# EAGLE board M.2 SoM breakout board v0.2 (EAGLE 9.6.2), part 1 of 2
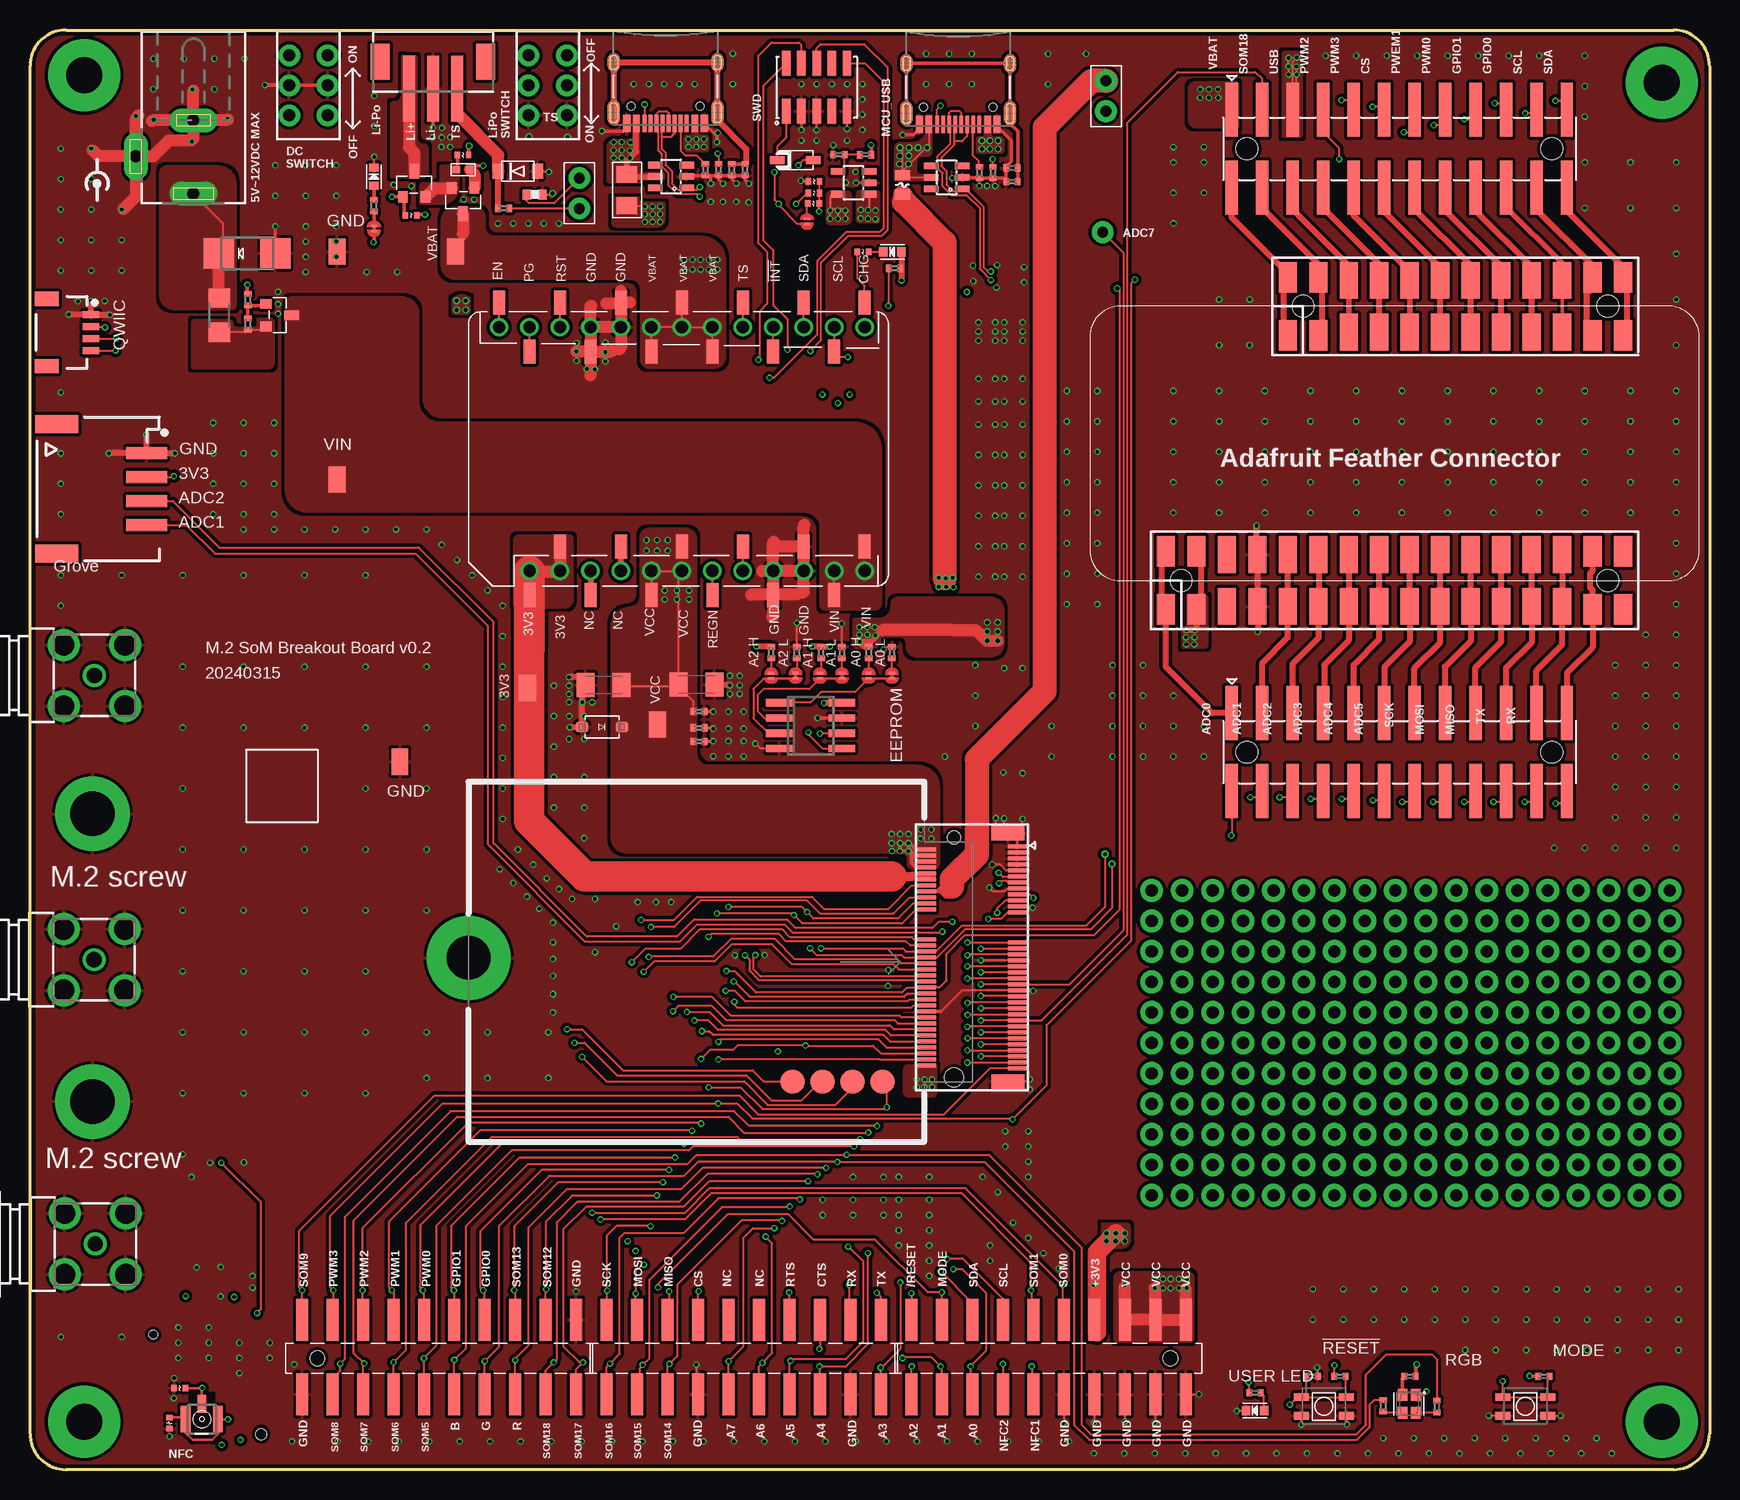
[diagram p3: board, top side]
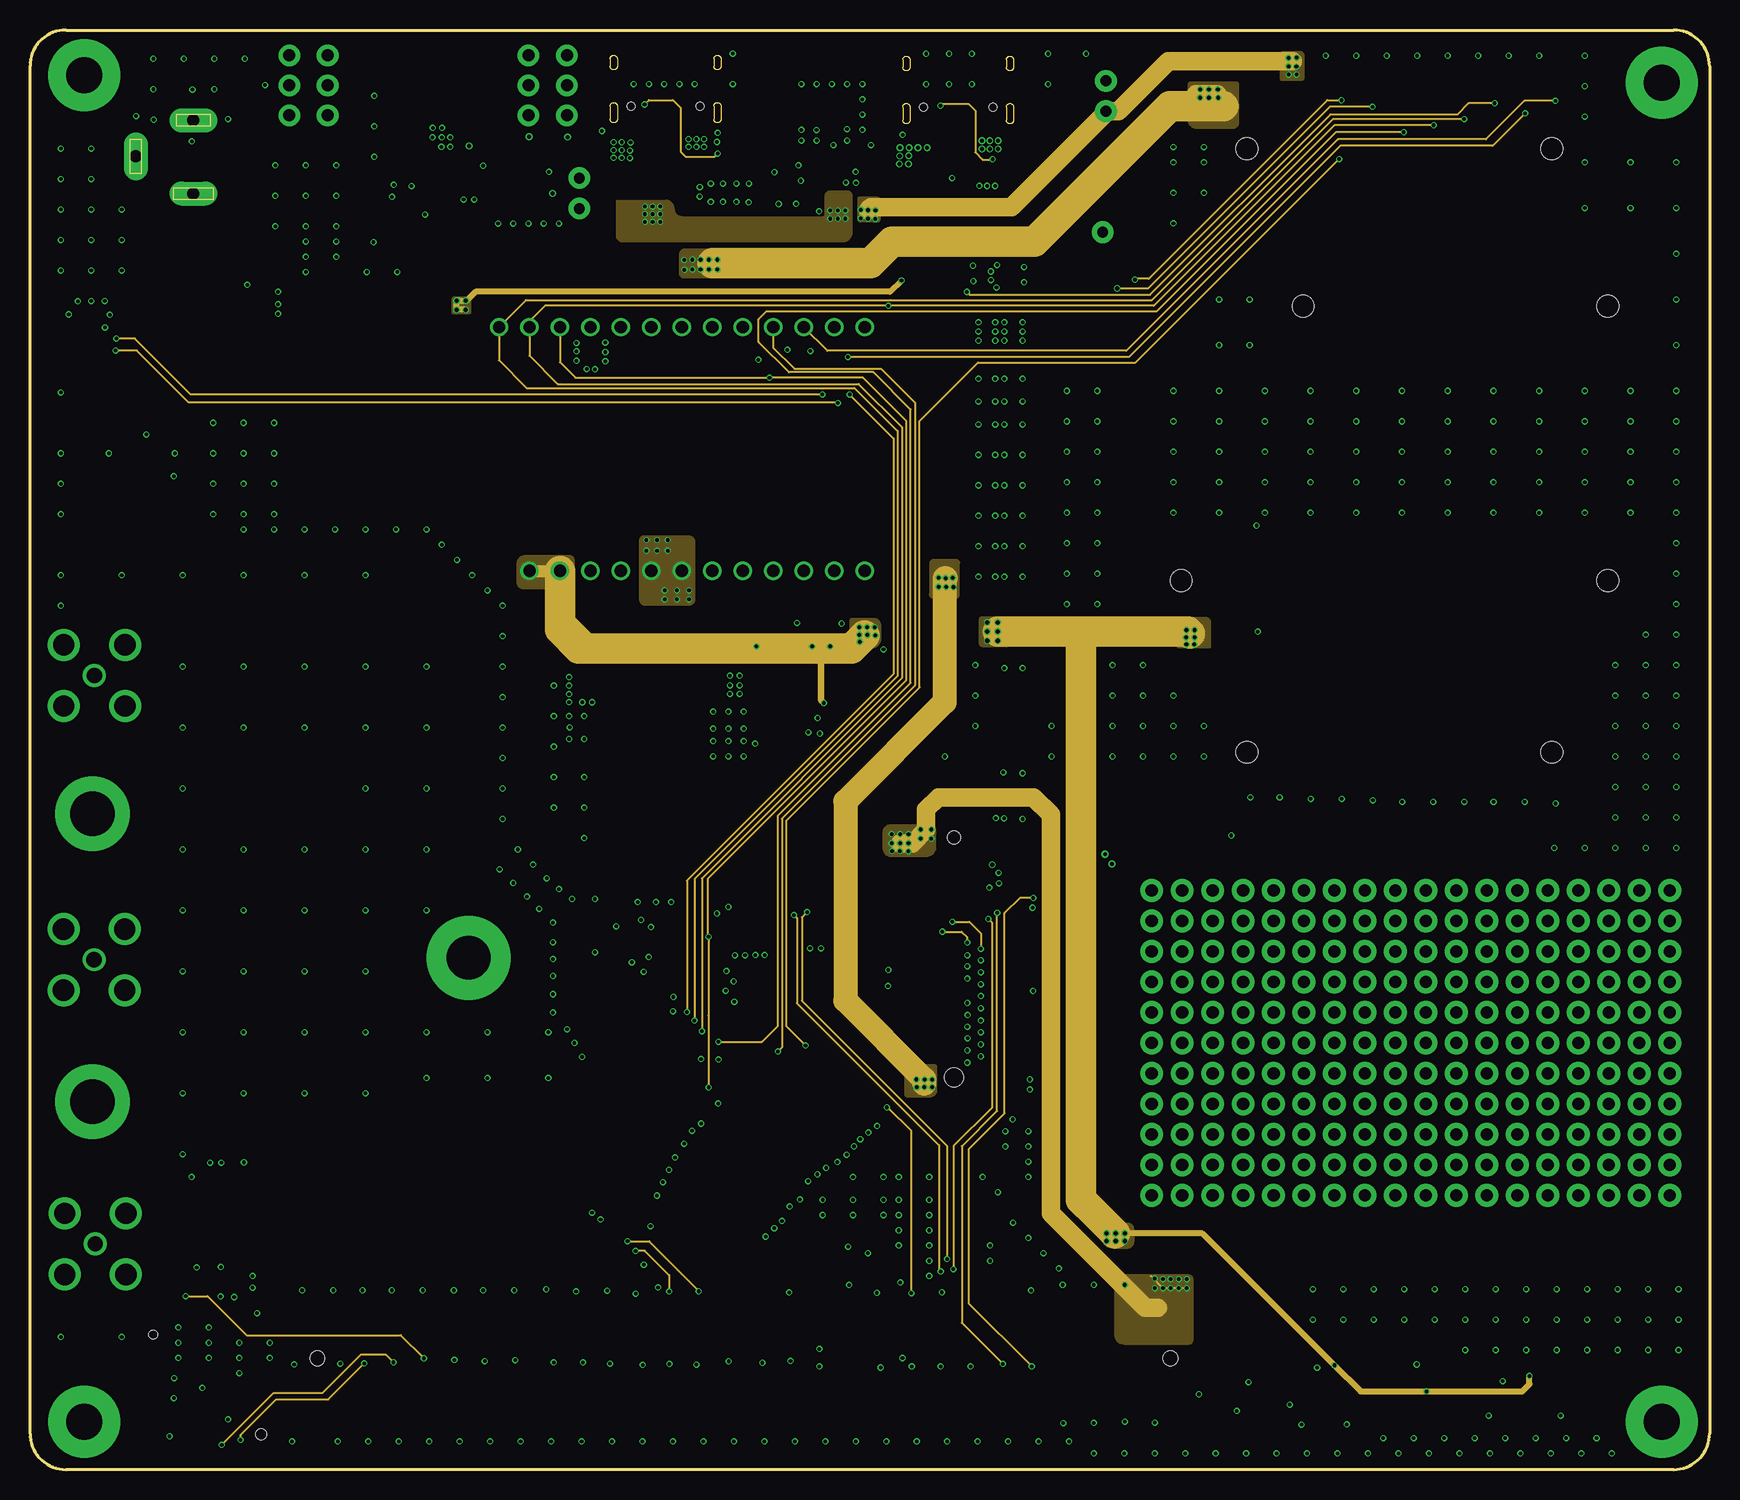
[diagram p4: board, inner layer VCC]
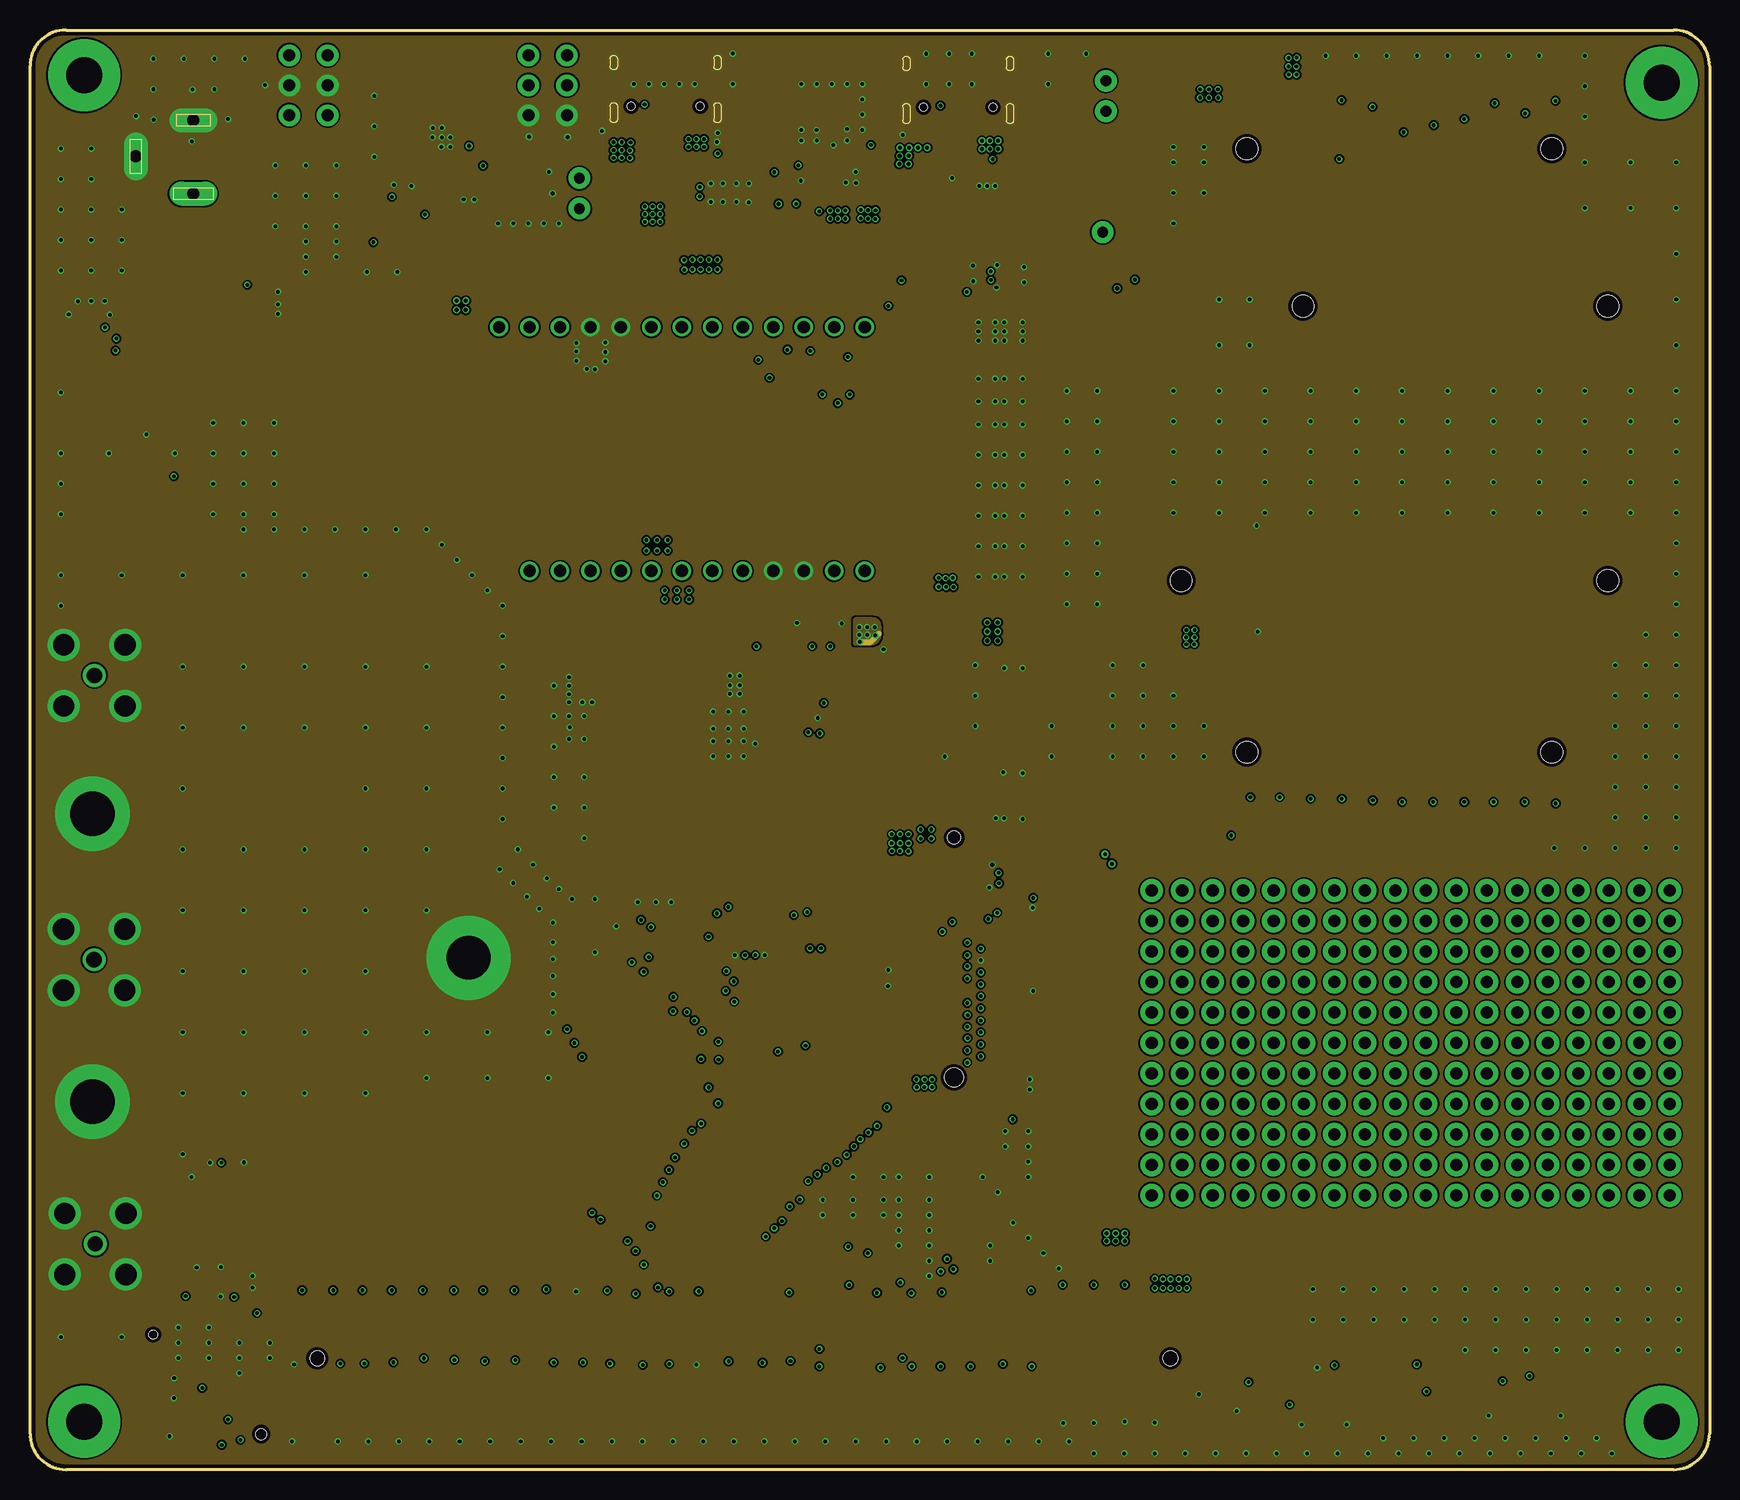
[diagram p5: board, inner layer GND]
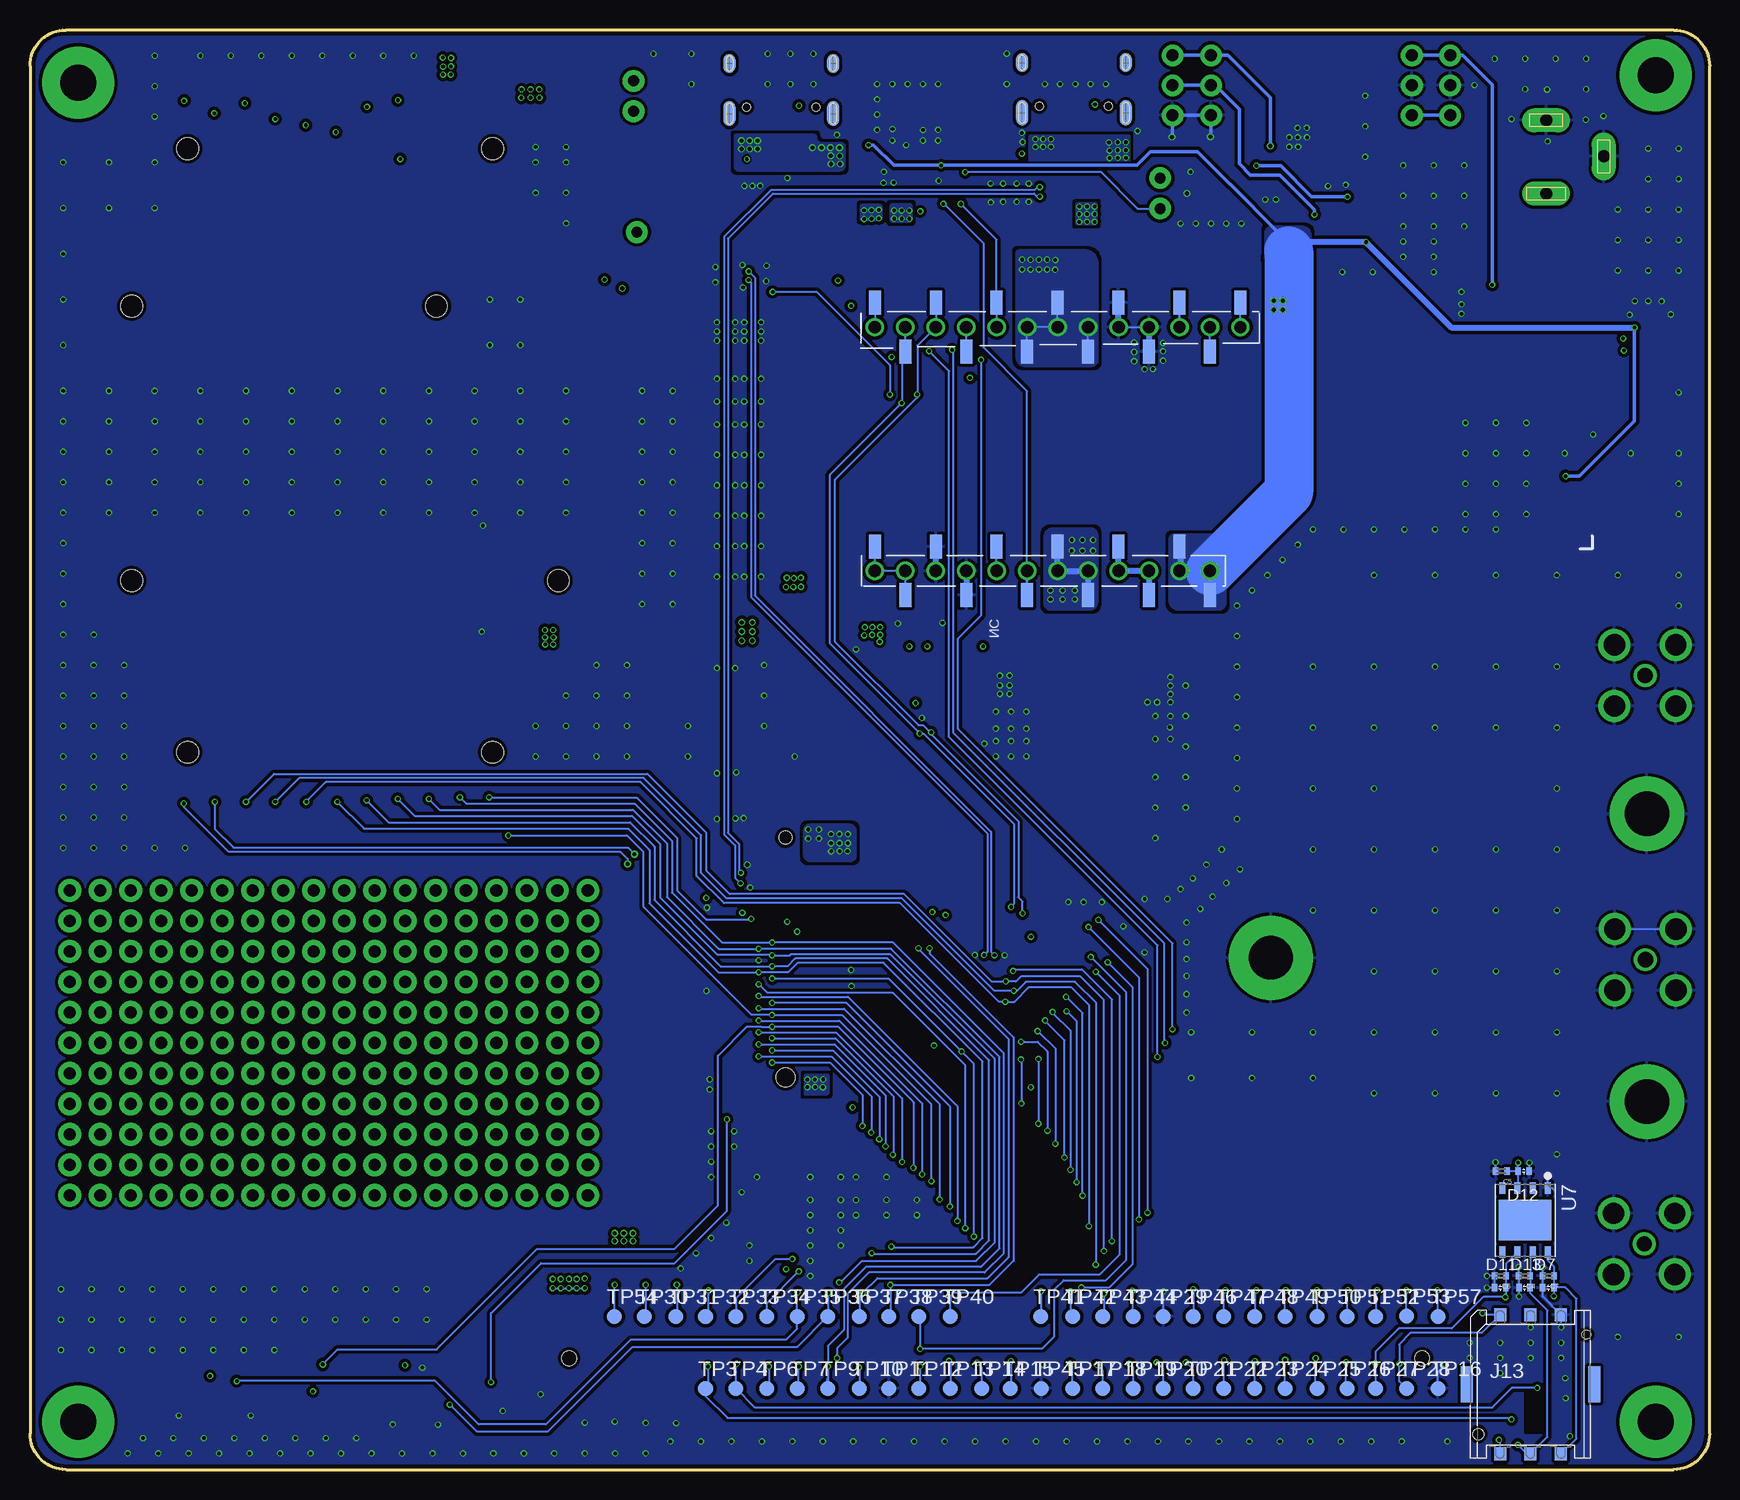
[diagram p6: board, bottom side, seen from below]

Size 140 x 120 mm. Coordinates in mm from the lower left corner, seen from the top.
Outline: 3,120 137,120 arc-90 140,117 140,3 arc-90 137,0 3,0 arc-90 0,3 0,117 arc-90 3,120
Copper layers (1+2*15+16): Top 0.035mm / dielectric 1.5mm / VCC 0.035mm / dielectric 0.15mm / GND 0.035mm / dielectric 0.2mm / Bottom 0.035mm
Design rules "default *": minimum track width 6mil, minimum drill 0.1mm, track to track 5mil, track to pad 5mil, pad to pad 5mil, via to via 5mil, smd to smd 5mil, copper to edge 12mil, drill to drill 6mil, minimum pad ring 4mil, minimum via ring 4mil, stop-mask expansion 4mil, vias tented up to drill 0.35mm, thermal gap 10mil
Net classes: 0 default: width 0.152 mm, clearance 0.152 mm; 1 power: width 0.254 mm, drill 0.61 mm, clearance 0.203 mm; 2 90R_Impedance: width 0.152 mm, drill 0.3 mm, clearance 0.152 mm; 3 BAT: clearance 0.203 mm

## Footprints (pad centres in the part's own frame; a part is rotated, then mirrored left to right if it is on the bottom)
S2751-46R = smd 2.2 x 1.4: 1 0,0
C0402_B = smd 0.457 x 0.61: 1 -0.483,0; 2 0.483,0
C1206K = smd 1.5 x 2: 1 -1.5,0; 2 1.5,0
SOT23-6 = smd 0.55 x 1.2: 1 -0.95,-1.3; 2 0,-1.3; 3 0.95,-1.3; 4 0.95,1.3; 5 0,1.3; 6 -0.95,1.3
SOD-123 = smd 1.2 x 0.7: 1 -1.5,0; 2 1.5,0
SOD-123FL = smd 0.91 x 1.22: A 1.637,0; C -1.637,0
C0402 = smd 0.45 x 0.6: 1 -0.47,0; 2 0.47,0
SOD-123' = smd 1.02 x 0.86: A 1.68,0; C -1.68,0
SMADIODE = smd 2.54 x 2.54: A 2.349,0; C -2.349,0
R1206 = smd 1.4 x 1.7: 1 -1.3,0; 2 1.3,0
F0805 = smd 0.85 x 1.25: P$1 -0.8,0; P$2 0.8,0
R1206' = smd 1.6 x 1.803: 1 -1.422,0; 2 1.422,0
JST-3-SMD-VERT = smd 1 x 5.5: 1 -2,0; 2 0,0; 3 2,0 | smd 1.6 x 3: PAD1 -4.4,-2.25; PAD2 4.4,-2.25
DCJ0202 = drill 1 pad 2 long: 1 0,3.1; 2 4.8,0; 3 0,-3
SPARK_CON_30X2_SMD = smd 1 x 3.5: 1 0,3.013; 2 0,-3.213; 3 2.54,3.013; 4 2.54,-3.213; 5 5.08,3.013; 6 5.08,-3.213; 7 7.62,3.013; 8 7.62,-3.213; 9 10.16,3.013; 10 10.16,-3.213; 11 12.7,3.013; 12 12.7,-3.213; 13 15.24,3.013; 14 15.24,-3.213; 15 17.78,3.013; 16 17.78,-3.213; 17 20.32,3.013; 18 20.32,-3.213; 19 22.86,3.013; 20 22.86,-3.213; 21 25.4,3.013; 22 25.4,-3.213; 23 27.94,3.013; 24 27.94,-3.213; 25 30.48,3.013; 26 30.48,-3.213; 27 33.02,3.013; 28 33.02,-3.213; 29 35.56,3.013; 30 35.56,-3.213; 31 38.1,3.013; 32 38.1,-3.213; 33 40.64,3.013; 34 40.64,-3.213; 35 43.18,3.013; 36 43.18,-3.213; 37 45.72,3.013; 38 45.72,-3.213; 39 48.26,3.013; 40 48.26,-3.213; 41 50.8,3.013; 42 50.8,-3.213; 43 53.34,3.013; 44 53.34,-3.213; 45 55.88,3.013; 46 55.88,-3.213; 47 58.42,3.013; 48 58.42,-3.213; 49 60.96,3.013; 50 60.96,-3.213; 51 63.5,3.013; 52 63.5,-3.213; 53 66.04,3.013; 54 66.04,-3.213; 55 68.58,3.013; 56 68.58,-3.213; 57 71.12,3.013; 58 71.12,-3.213; 59 73.66,3.013; 60 73.66,-3.213 | hole 1.2: 1.27,0; 72.39,0
1X04_1MM_RA = smd 0.6 x 1.35: 1 -1.5,0; 2 -0.5,0; 3 0.5,0; 4 1.5,0 | smd 1.2 x 2: NC1 2.8,-3.675; NC2 -2.8,-3.675
SCREW-HOLE-3.7 = drill 3.7 pad 6.2: P$1 0,0
PARTICLE-SZ_PARTICLE-POWER-MODULE = smd 1 x 2 bottom: 1 5.08,-0.762; 2 7.62,3.302; 3 10.16,-0.762; 4 12.7,3.302; 5 15.24,-0.762; 6 17.78,3.302; 7 20.32,-0.762; 8 22.86,3.302; 9 25.4,-0.762; 10 27.94,3.302; 11 30.48,-0.762; 12 33.02,3.302; 13 33.02,23.622; 14 30.48,19.55; 15 27.94,23.622; 16 25.4,19.55; 17 22.86,23.622; 18 20.32,19.55; 19 17.78,23.622; 20 15.24,19.55; 21 12.7,23.622; 22 10.16,19.55; 23 7.62,23.622; 24 5.08,19.558; 25 2.54,23.622 | smd 1 x 2: @1 5.08,-0.762; @2 7.62,3.302; @3 10.16,-0.762; @4 12.7,3.302; @5 15.24,-0.762; @6 17.78,3.302; @7 20.32,-0.762; @8 22.86,3.302; @9 25.4,-0.762; @10 27.94,3.302; @11 30.48,-0.762; @12 33.02,3.302; @13 33.02,23.622; @14 30.48,19.55; @15 27.94,23.622; @16 25.4,19.55; @17 22.86,23.622; @18 20.32,19.55; @19 17.78,23.622; @20 15.24,19.55; @21 12.7,23.622; @22 10.16,19.55; @23 7.62,23.622; @24 5.08,19.558; @25 2.54,23.622 | drill 1.016 pad 1.524: P$1 5.08,1.27; P$2 7.62,1.27; P$3 10.16,1.27; P$4 12.7,1.27; P$5 15.24,1.27; P$6 17.78,1.27; P$7 20.32,1.27; P$8 22.86,1.27; P$9 25.4,1.27; P$10 27.94,1.27; P$11 30.48,1.27; P$12 33.02,1.27; P$13 33.02,21.59; P$14 30.48,21.59; P$15 27.94,21.59; P$16 25.4,21.59; P$17 22.86,21.59; P$18 20.32,21.59; P$19 17.78,21.59; P$20 15.24,21.59; P$21 12.7,21.59; P$22 10.16,21.59; P$23 7.62,21.59; P$24 5.08,21.59; P$25 2.54,21.59
TP_OPEN = smd 0.2 x 0.5: 1 -0.21,0; 2 0.21,0
CON_12*2_SMD_HEADER = smd 1.02 x 4.5: 1 0,0.65; 2 0,-5.85; 3 2.54,0.65; 4 2.54,-5.85; 5 5.08,0.65; 6 5.08,-5.85; 7 7.62,0.65; 8 7.62,-5.85; 9 10.16,0.65; 10 10.16,-5.85; 11 12.7,0.65; 12 12.7,-5.85; 13 15.24,0.65; 14 15.24,-5.85; 15 17.78,0.65; 16 17.78,-5.85; 17 20.32,0.65; 18 20.32,-5.85; 19 22.86,0.65; 20 22.86,-5.85; 21 25.4,0.65; 22 25.4,-5.85; 23 27.94,0.65; 24 27.94,-5.85 | hole 1.8: 1.27,-2.6; 26.67,-2.6
WAFER-HY2.0-4PWB = smd 1 x 3.4: 1 -3,3.7; 2 -1,3.7; 3 1,3.7; 4 3,3.7 | smd 1.5 x 3.6: NC1 5.4,-3.8; NC2 -5.4,-3.8
GCT-SIM8100 = smd 1 x 1.1: C1 2.54,-5.8; C2 0,-5.8; C3 -2.54,-5.8; C5 2.54,5.8; C6 0,5.8; C7 -2.54,5.8 | smd 1 x 3: NC@1 -5.3,0; NC@2 5.3,0 | hole 0.7: 4.65,4.15 | hole 0.9: -4.35,-4.15
SIP-2 = drill 0.9 pad 1.8: 1 -1.27,0; 2 1.27,0
CONN5X2_1.27 = smd 0.7 x 2.1: 1 -2.54,-2; 2 -2.54,2; 3 -1.27,-2; 4 -1.27,2; 5 0,-2; 6 0,2; 7 1.27,-2; 8 1.27,2; 9 2.54,-2; 10 2.54,2
LED0603 = smd 0.7 x 0.8: 1 -0.75,0; 2 0.75,0
TACTILE_SWITCH_SMD = smd 1.25 x 0.65: 1 -1.875,0.775; 2 1.875,0.775; 3 -1.875,-0.775; 4 1.875,-0.775
FEATHERWING_SMT2 = smd 1.524 x 2.54: 1 6.35,2.413; 1' 6.35,-2.413; 2 8.89,2.413; 2' 8.89,-2.413; 15 41.91,2.413; 15' 41.91,-2.413; 16 44.45,2.413; 16' 44.45,-2.413; 17 44.45,20.447; 17' 44.45,25.273; 18 41.91,20.447; 18' 41.91,25.273; 27 19.05,20.447; 27' 19.05,25.273; 28 16.51,20.447; 28' 16.51,25.273 | smd 1.524 x 3.048: 3 11.43,2.159; 3' 11.43,-2.159; 4 13.97,2.159; 4' 13.97,-2.159; 5 16.51,2.159; 5' 16.51,-2.159; 6 19.05,2.159; 6' 19.05,-2.159; 7 21.59,2.159; 7' 21.59,-2.159; 8 24.13,2.159; 8' 24.13,-2.159; 9 26.67,2.159; 9' 26.67,-2.159; 10 29.21,2.159; 10' 29.21,-2.159; 11 31.75,2.159; 11' 31.75,-2.159; 12 34.29,2.159; 12' 34.29,-2.159; 13 36.83,2.159; 13' 36.83,-2.159; 14 39.37,2.159; 14' 39.37,-2.159; 19 39.37,20.701; 19' 39.37,25.019; 20 36.83,20.701; 20' 36.83,25.019; 21 34.29,20.701; 21' 34.29,25.019; 22 31.75,20.701; 22' 31.75,25.019; 23 29.21,20.701; 23' 29.21,25.019; 24 26.67,20.701; 24' 26.67,25.019; 25 24.13,20.701; 25' 24.13,25.019; 26 21.59,20.701; 26' 21.59,25.019 | hole 1.8: 17.78,22.86; 43.18,22.86; 7.62,0; 43.18,0
IPEX-20279-001E = smd 0.73 x 1.5: 1 0,1.28 | smd 0.8 x 2.2: 2@1 -1.35,0; 2@2 1.35,0
SOT-23 = smd 0.8 x 0.95: 1 -0.95,-1; 2 0.95,-1 | smd 0.8 x 1.25: 3 0,1.15
R0402_B = smd 0.457 x 0.61: 1 -0.483,0; 2 0.483,0
R-0402S = smd 0.45 x 0.55: 1 -0.47,0; 2 0.47,0
R0603_P = smd 0.7 x 0.85: 1 -0.65,0; 2 0.65,0
R0603 = smd 0.6 x 0.6: 1 -0.55,0; 2 0.55,0
PLCC4-2MM-RGB = smd 1 x 0.8: BLUE -0.75,-0.55; CA 0.75,-0.55; GREEN -0.75,0.55; RED 0.75,0.55
SWITCH-2.5X3.2-6 = drill 1 pad 1.8: 1 0,0; 2 0,2.5; 3 0,5; 4 3.2,0; 5 3.2,2.5; 6 3.2,5
TP_SHORT = smd 0.2 x 0.5: 1 -0.21,0; 2 0.21,0
TPEB = drill 0.9 pad 1.8: 1 0,0
B1,27 = smd 1.27 x 1.27: TP 0,0
SOT25 = smd 0.55 x 1.2: 1 -0.95,-1.3; 2 0,-1.3; 3 0.95,-1.3; 4 0.95,1.3; 5 -0.95,1.3
SO-08 = smd 0.6 x 2.2: 1 -1.905,-2.6; 2 -0.635,-2.6; 3 0.635,-2.6; 4 1.905,-2.6; 5 1.905,2.6; 6 0.635,2.6; 7 -0.635,2.6; 8 -1.905,2.6
MFF2 = smd 0.96 x 0.5: 1 -2.675,1.905; 2 -2.675,0.635; 3 -2.675,-0.635; 4 -2.675,-1.905; 5 2.675,-1.905; 6 2.675,-0.635; 7 2.675,0.635; 8 2.675,1.905 | smd 3.4 x 4.4: P$1 0,0
PARTICLE-STUDIOS_PARTICLE_M.2EKEY_3.65MM_DRILL = smd 0.3 x 1.55: 1 -9.62,3.735; 2 -9.37,-3.815; 3 -9.12,3.735; 4 -8.87,-3.815; 5 -8.62,3.735; 6 -8.37,-3.815; 7 -8.12,3.735; 8 -7.87,-3.815; 9 -7.62,3.735; 10 -7.37,-3.815; 11 -7.12,3.735; 12 -6.87,-3.815; 13 -6.62,3.735; 14 -6.37,-3.815; 15 -6.12,3.735; 16 -5.87,-3.815; 17 -5.62,3.735; 18 -5.37,-3.815; 19 -5.12,3.735; 20 -4.87,-3.815; 21 -4.62,3.735; 22 -4.37,-3.815; 23 -4.12,3.735; 32 -1.87,-3.815; 33 -1.62,3.735; 34 -1.37,-3.815; 35 -1.12,3.735; 36 -0.87,-3.815; 37 -0.62,3.735; 38 -0.37,-3.815; 39 -0.12,3.735; 40 0.13,-3.815; 41 0.38,3.735; 42 0.63,-3.815; 43 0.88,3.735; 44 1.13,-3.815; 45 1.38,3.735; 46 1.63,-3.815; 47 1.88,3.735; 48 2.13,-3.815; 49 2.38,3.735; 50 2.63,-3.815; 51 2.88,3.735; 52 3.13,-3.815; 53 3.38,3.735; 54 3.63,-3.815; 55 3.88,3.735; 56 4.13,-3.815; 57 4.38,3.735; 58 4.63,-3.815; 59 4.88,3.735; 60 5.13,-3.815; 61 5.38,3.735; 62 5.63,-3.815; 63 5.88,3.735; 64 6.13,-3.815; 65 6.38,3.735; 66 6.63,-3.815; 67 6.88,3.735; 68 7.13,-3.815; 69 7.38,3.735; 70 7.63,-3.815; 71 7.88,3.735; 72 8.13,-3.815; 73 8.38,3.735; 74 8.63,-3.815; 75 8.88,3.735 | smd 1.2 x 2.75: 76 9.98,2.96; 77 -10.72,2.96 | drill 3.65 pad 7: 78 -0.351,-42 | smd 2 x 2: !RESET 10,-7.5; SWCLK 10,-15; SWDIO 10,-12.5; SWO 10,-10 | hole 1.1: -10.37,-1.54 | hole 1.55: 9.63,-1.54
USB-C-16P = smd 0.3 x 1.45: A5 -1.25,0; A6 -0.25,0; A7 0.25,0; A8 1.25,0; B5 1.75,0; B6 0.75,0; B7 -0.75,0; B8 -1.75,0 | smd 0.6 x 1.45: GND -3.225,0; GND2 3.225,0 | smd 1 x 2.1: SHLD1 -4.32,-0.915; SHLD2 4.32,-0.915 | smd 1 x 2.1 bottom: SHLD3 -4.32,-0.915; SHLD4 4.32,-0.915 | smd 1 x 1.6: SHLD5 -4.32,-5.095; SHLD8 4.32,-5.095 | smd 1 x 1.6 bottom: SHLD6 -4.32,-5.095; SHLD7 4.32,-5.095 | smd 0.55 x 1.45: VBUS1 -2.45,0; VBUS2 2.45,0 | hole 0.65: -2.89,-1.445; 2.89,-1.445
BU-SMA-G = drill 1.27: 1 0,0 | drill 1.778: 2 -2.55,2.55; 3 2.55,2.55; 4 2.55,-2.55; 5 -2.55,-2.55

## Placement (x,y rotation side)
3V3  [S2751-46R]  41.48,65.15 90 top
C1  0.1uF  [C0402_B]  106.88,7.78 0 top
C2  0.1uF  [C0402_B]  81.85,107.35 180 top
C3  0.1uF  [C0402_B]  59.61,108.34 270 top
C4  33pF  [C0402_B]  15.43,16.15 180 bottom
C5  33pF  [C0402_B]  17.35,24.87 180 bottom
C6  33pF  [C0402_B]  17.45,16.15 180 bottom
C7  0.1uF  [C0402_B]  13.43,16.15 180 bottom
C8  1nF  [C0402_B]  55.77,63.18 0 top
C9  100pF  [C0402_B]  55.77,60.69 0 top
C10  33pF  [C0402_B]  55.77,61.82 0 top
C20  100uF  [C1206K]  55.57,65.42 0 top
C61  100uF  [C1206K]  47.83,65.39 180 top
D1  TPESD0504S6  [SOT23-6]  53.44,107.78 90 top
D2  B5819w  [SOD-123]  63.78,109.15 180 top
D4  SMF3.3  [SOD-123FL]  40.67,108.23 0 top
D7  0402ESDA-05N  [C0402]  13.43,15.16 0 bottom
D11  0402ESDA-05N  [C0402]  17.45,15.16 0 bottom
D12  0402ESDA-05N  [C0402]  15.5,24.87 180 bottom
D13  0402ESDA-05N  [C0402]  15.42,15.16 0 bottom
D16  BZT52C3V9  [SOD-123']  47.69,61.89 180 top
D17  SMAJ15CA-13-F  [SMADIODE]  18.11,101.38 0 top
D23  DNP MAX3207EAUT+T  [SOT23-6]  76.42,107.7 90 top
F2  RF1512-000  [R1206]  49.76,106.67 270 top
F4  Fuse  [F0805]  72.71,107.09 90 top
F5  16V/0.75A  [R1206']  15.79,96.22 270 top
GND  [S2751-46R]  25.61,101.52 90 top
GND15  [S2751-46R]  30.84,59 90 top
J1  [JST-3-SMD-VERT]  33.59,115.1 180 top
J2  DCJ0202  [DCJ0202]  13.62,109.46 180 top
J3  SPARK_CON_30X2_SMD  [SPARK_CON_30X2_SMD]  96.33,9.27 180 top
J4  [1X04_1MM_RA]  5.09,94.78 270 top
J5  SCREW-HOLE-3.7  [SCREW-HOLE-3.7]  5.21,54.66 0 top
J6  PARTICLE-SZ_PARTICLE-POWER-MODULE  [PARTICLE-SZ_PARTICLE-POWER-MODULE]  36.56,73.64 0 top
J7  SCREW-HOLE-3.7  [SCREW-HOLE-3.7]  5.21,30.68 0 top
J8  TP_OPEN  [TP_OPEN]  64.77,104.04 90 top
J10  CON_122_SMD_HEADER  [CON_12*2_SMD_HEADER]  100.17,112.7 0 top
J11  WAFER-HY2.0-4PWB  [WAFER-HY2.0-4PWB]  6.02,81.74 270 top
J12  TP_OPEN  [TP_OPEN]  61.78,66.16 270 top
J13  SIM-NANO-4FF  [GCT-SIM8100]  14.92,7.11 0 bottom
J15  CON_122_SMD_HEADER  [CON_12*2_SMD_HEADER]  100.17,62.4 0 top
J19  TP_OPEN  [TP_OPEN]  65.85,66.16 270 top
J20  TP_OPEN  [TP_OPEN]  69.91,66.16 270 top
J21  SIP-2  [SIP-2]  45.78,106.38 90 top
J22  SIP-2  [SIP-2]  89.69,114.5 270 top
JTAG  CONN5X2  [CONN5X2_1.27]  65.57,115.22 0 top
LED1  RED  [LED0603]  28.67,107.77 90 top
LED2  BLUE  [LED0603]  102.11,4.91 180 top
LED3  yellow  [LED0603]  71.88,101.51 180 top
MODE  [TACTILE_SWITCH_SMD]  124.65,5.26 180 top
MS1  PARTICLE_MESH_SMTDUAL  [FEATHERWING_SMT2]  88.34,74.11 0 top
NFC  UFL  [IPEX-20279-001E]  14.33,4.2 0 top
Q3  HSS2333  [SOT-23]  36.1,105.82 180 top
Q4  HSS2333  [SOT-23]  20.66,96.22 270 top
Q5  HSS2333  [SOT-23]  32.03,107.09 0 top
R1  5.1k  [R0402_B]  79.15,108.11 270 top
R2  1K  [R0402_B]  69.64,109.59 0 top
R3  5.1k  [R0402_B]  80.27,108.11 270 top
R4  10K  [R0402_B]  109.2,7.78 180 top
R5  1M  [R0402_B]  81.85,108.5 180 top
R6  5.1k  [R0402_B]  56.3,108.34 270 top
R7  1M  [R0402_B]  67.42,109.6 180 top
R8  1K  [R0402_B]  117.26,5.25 270 top
R9  5.1k  [R0402_B]  57.4,108.34 270 top
R10  1M  [R0402_B]  58.51,108.34 270 top
R11  1K  [R0402_B]  102.11,6.4 180 top
R12  DNP  [R0402_B]  126.18,7.78 180 top
R13  1K  [R-0402S]  69.44,101.51 180 top
R14  100K  [R0402_B]  18.16,95.49 270 top
R15  1K  [R0402_B]  18.16,97.51 270 top
R16  1K  [R0402_B]  28.67,105.35 270 top
R18  nc  [R-0402S]  65.34,106.4 180 top
R19  1K  [R0402_B]  112.79,5.32 270 top
R20  1K  [R0402_B]  115.04,7.78 180 top
R21  1M/NC  [R0402_B]  72.06,100.13 0 top
R22  10K  [R0603_P]  42.06,106.27 180 top
R23  0R  [R0402_B]  39.47,105.13 180 top
R24  10K  [R0402_B]  61.78,68.11 90 top
R25  10K  [R0402_B]  65.95,68.11 90 top
R26  10K  [R0402_B]  69.91,68.11 90 top
R27  100K  [R0402_B]  63.92,68.11 90 top
R28  100K  [R0402_B]  67.68,68.11 90 top
R29  100K  [R0402_B]  71.84,68.11 90 top
R30  100K  [R0603]  36.1,108.36 180 top
R31  1K  [R-0402S]  31.78,104.55 0 top
R32  nc  [R-0402S]  65.31,105.54 180 top
R33  1K  [R-0402S]  36.1,109.58 180 top
R37  ESD NC  [R-0402S]  11.62,3.87 270 top
R38  ESD NC  [R-0402S]  12.48,6.78 0 top
R74  nc  [R-0402S]  65.34,107.37 0 top
RESET  [TACTILE_SWITCH_SMD]  107.86,5.26 180 top
RGB  RGB-LED-CLMVB-FKARGB  [PLCC4-2MM-RGB]  114.95,5.47 90 top
S1  [SWITCH-2.5X3.2-6]  21.61,112.89 0 top
S4  [SWITCH-2.5X3.2-6]  44.76,117.89 180 top
T1  TP_SHORT  [TP_SHORT]  28.67,103.44 90 top
TP1  TPTPEB  [TPEB]  89.41,103.15 0 top
TP3  TPSB1,27  [B1,27]  83.69,6.76 0 bottom
TP4  TPSB1,27  [B1,27]  81.16,6.76 0 bottom
TP6  TPSB1,27  [B1,27]  78.59,6.76 0 bottom
TP7  TPSB1,27  [B1,27]  76.04,6.76 0 bottom
TP9  TPSB1,27  [B1,27]  73.5,6.76 0 bottom
TP10  TPSB1,27  [B1,27]  70.87,6.76 0 bottom
TP11  TPSB1,27  [B1,27]  68.4,6.76 0 bottom
TP12  TPSB1,27  [B1,27]  65.92,6.76 0 bottom
TP13  TPSB1,27  [B1,27]  63.3,6.76 0 bottom
TP14  TPSB1,27  [B1,27]  60.66,6.76 0 bottom
TP15  TPSB1,27  [B1,27]  58.29,6.76 0 bottom
TP16  TPSB1,27  [B1,27]  22.64,6.76 0 bottom
TP17  TPSB1,27  [B1,27]  53.08,6.76 0 bottom
TP18  TPSB1,27  [B1,27]  50.58,6.76 0 bottom
TP19  TPSB1,27  [B1,27]  48.03,6.76 0 bottom
TP20  TPSB1,27  [B1,27]  45.52,6.76 0 bottom
TP21  TPSB1,27  [B1,27]  43.03,6.76 0 bottom
TP22  TPSB1,27  [B1,27]  40.49,6.76 0 bottom
TP23  TPSB1,27  [B1,27]  37.91,6.76 0 bottom
TP24  TPSB1,27  [B1,27]  35.38,6.76 0 bottom
TP25  TPSB1,27  [B1,27]  32.69,6.76 0 bottom
TP26  TPSB1,27  [B1,27]  30.2,6.76 0 bottom
TP27  TPSB1,27  [B1,27]  27.81,6.76 0 bottom
TP28  TPSB1,27  [B1,27]  25.25,6.76 0 bottom
TP29  TPSB1,27  [B1,27]  45.52,12.77 0 bottom
TP30  TPSB1,27  [B1,27]  88.8,12.77 0 bottom
TP31  TPSB1,27  [B1,27]  86.15,12.77 0 bottom
TP32  TPSB1,27  [B1,27]  83.69,12.77 0 bottom
TP33  TPSB1,27  [B1,27]  81.16,12.77 0 bottom
TP34  TPSB1,27  [B1,27]  78.59,12.77 0 bottom
TP35  TPSB1,27  [B1,27]  76.04,12.77 0 bottom
TP36  TPSB1,27  [B1,27]  73.5,12.77 0 bottom
TP37  TPSB1,27  [B1,27]  70.87,12.77 0 bottom
TP38  TPSB1,27  [B1,27]  68.4,12.77 0 bottom
TP39  TPSB1,27  [B1,27]  65.92,12.77 0 bottom
TP40  TPSB1,27  [B1,27]  63.3,12.77 0 bottom
TP41  TPSB1,27  [B1,27]  55.75,12.77 0 bottom
TP42  TPSB1,27  [B1,27]  53.08,12.77 0 bottom
TP43  TPSB1,27  [B1,27]  50.58,12.77 0 bottom
TP44  TPSB1,27  [B1,27]  48.03,12.77 0 bottom
TP45  TPSB1,27  [B1,27]  55.7,6.76 0 bottom
TP46  TPSB1,27  [B1,27]  43.03,12.77 0 bottom
TP47  TPSB1,27  [B1,27]  40.49,12.77 0 bottom
TP48  TPSB1,27  [B1,27]  37.91,12.77 0 bottom
TP49  TPSB1,27  [B1,27]  35.38,12.77 0 bottom
TP50  TPSB1,27  [B1,27]  32.69,12.77 0 bottom
TP51  TPSB1,27  [B1,27]  30.2,12.77 0 bottom
TP52  TPSB1,27  [B1,27]  27.81,12.77 0 bottom
TP53  TPSB1,27  [B1,27]  25.25,12.81 0 bottom
TP54  TPSB1,27  [B1,27]  91.3,12.77 0 bottom
TP57  TPSB1,27  [B1,27]  22.64,12.77 0 bottom
U1  XC8107  [SOT25]  68.65,107.26 90 top
U2  AT24CS64-SSHM-B  [SO-08]  65.07,62.02 270 top
U7  NC  [MFF2]  15.37,20.79 270 bottom
U$2  TP_SHORT  [TP_SHORT]  63.82,66.16 270 top
U$3  TP_SHORT  [TP_SHORT]  67.68,66.16 270 top
U$4  PARTICLE-STUDIOS_M_SERIES_M.2KEY  [PARTICLE-STUDIOS_PARTICLE_M.2EKEY_3.65MM_DRILL]  78.56,42.31 270 top
U$6  PARTICLE-LOGO  [PARTICLE-LOGO]  16.37,72.5 0 top
U$7  TP_SHORT  [TP_SHORT]  71.84,66.16 270 top
USB1  [USB-C-16P]  52.98,112.19 180 top
USB2  [USB-C-16P]  77.37,112.12 180 top
VBAT  [S2751-46R]  35.49,101.52 270 top
VCC  [S2751-46R]  52.3,62.1 90 top
VIN  [S2751-46R]  25.61,82.52 90 top
X1  BU-SMA-G  [BU-SMA-G]  5.44,18.81 180 top
X2  BU-SMA-G  [BU-SMA-G]  5.37,66.19 180 top
X3  BU-SMA-G  [BU-SMA-G]  5.34,42.5 180 top

## Tracks (layer width: path | path; a pad name or v marks a point on that pad's centre or on a via)
5VDC
  Top 0.152: 49.26,76.83 J6.4
  Top 0.508: J6.P$3 J6.@3 | J6.P$4 49.26,76.83
  Bottom 0.152: J6.P$4 49.26,74.93 | 49.26,74.93 49.26,76.71 J6.4 | 46.72,73.15 J6.@3 | J6.P$3 46.73,74.93 49.26,74.93
  Bottom 0.508: 46.72,73.15 J6.P$3 J6.P$4 49.26,76.71
!MODE  (via drill 0.3 pad 0.5)
  Top 0.152: U$4.32 73.69,44.18 73.48,44.4 63.33,44.4 62.72,45 55.83,45 54.24,43.41 51.29,43.41 v50.17,42.28 | J3.18 76.01,14.77 v76,14.77 74.84,14.77 70.41,19.2 65.28,19.2 63.17,21.31 58.19,21.31 52.35,15.47 v52.35,15.18 | R12.1 126.52,7.64 MODE.3 MODE.4 122.77,7.36 v122.76,7.37
  Bottom 0.152: v76,14.77 76.04,14.77 TP35.TP 76.04,11.74 76.97,10.82 89.92,10.82 96.98,3.76 102.59,3.76 106.25,7.42 122.71,7.42 v122.76,7.37 | v50.17,42.28 48.11,40.23 48.11,17.1 50.05,15.16 52.33,15.16 v52.35,15.18
!RESET  (via drill 0.3 pad 0.5)
  Top 0.152: v73.47,14.7 J3.20 | C1.1 106.39,6.45 106.09,6.15 | 106.09,6.15 RESET.4 RESET.3 109.68,6.09 R4.1 | JTAG.10 69.59,117.22 71.18,115.63 71.18,103.5 70.85,103.17 68.06,103.17 65.65,100.76 65.65,94.63 62.03,91.01 v61.65,91.01 | v105.01,5.41 105.75,6.15 106.09,6.15 | U$4.34 73.38,43.68 73.02,44.04 63.04,44.04 62.45,44.63 56.77,44.63 v56.56,44.41 | U$4.!RESET 70.83,32.31 71.43,31.71 v71.43,30.18 71.3,30.05 61.04,30.05 59.25,31.85 v56.57,31.85 | J6.23 J6.P$23
  VCC 0.152: v73.47,14.7 73.47,28.21 71.5,30.18 v71.43,30.18 | J6.P$23 44.18,92.3 45.47,91.01 v61.65,91.01 69.42,91.01 73.05,87.38 73.05,65.81 56.51,49.27 56.51,44.46 v56.56,44.41 56.56,37.83 56.57,37.82 v56.57,31.85
  Bottom 0.152: v73.47,14.7 73.47,12.77 TP36.TP 76.08,10.2 89.81,10.2 96.85,3.15 102.72,3.15 104.98,5.41 v105.01,5.41 | 44.61,97.66 44.18,97.23 J6.P$23 J6.23
+3V3  (via drill 0.3 pad 0.5, 0.35)
  Top 0.152: v88.67,15.39 v88.66,15.38 88.66,12.53 J3.8 | R4.2 108.71,8.66 v108.74,8.69 | J4.2 6.17,95.28 v6.25,95.2 | J11.2 11.93,82.74 v11.99,82.8 | 28.67,102.35 v28.63,102.31 | v66.18,63.9 v66.17,63.89 | v72.65,99.12 | MS1.2 97.67,76.09 97.67,75.74 | J6.@1 41.64,74.47 41.64,74.83 J6.P$1 | v70.46,69.53 69.91,68.98 R26.2 | D2.1 64.47,109.15 64.05,108.72 v64.05,108.71
  Top 0.305: U$4.10 U$4.12 73.81,49.18 73.56,49.44 74.5,49.44 U$4.10 | 73.48,49.43 73.74,49.68 U$4.10 | v70.1,110.41 70.13,110.38 R2.2 | R12.2 125.02,7.78 v125,7.8 | v116.41,6.5 116.13,6.22 RGB.CA | R21.2 72.63,100.13 72.65,100.1 | T1.1 28.67,102.35
  Top 0.457: v65.2,68.62 65.93,68.62 R25.2 65.97,68.62 v66.7,68.62
  Top 0.508: 97.67,76.96 97.67,75.74 97.67,72.23 97.23,71.79 MS1.2' 97.23,70.13 v97.08,69.98 v96.4,69.98 | LED3.1 72.63,100.13 | 72.65,100.1 v72.65,99.12 | U2.8 67.65,63.9 v66.18,63.9 | v79.78,69.09 78.9,69.98 76.94,69.98 | 71.03,69.98 70.06,69 v69.17,69 69.57,68.6 R26.2 | R24.2 60.58,68.6 v60.56,68.62 | 65.92,68.62 v65.21,68.62 v65.2,68.62 | 65.63,68.62 v66.7,68.62
  Top 0.762: 75.11,49.44 73.56,49.44 71.81,49.44
  Top 1.016: J6.@2 J6.P$2 44.09,74.83 41.64,74.83 | 71.03,69.98 76.94,69.98 78.84,69.98 79.73,69.09 v80.67,69.09 | J3.8 88.71,17.97 90.43,19.68 v90.5,19.68 | 3V3.1 41.61,65.28 41.61,66.14
  Top 1.524: 41.61,74.45 41.64,74.47 | v90.5,19.68 88.93,18.11 88.93,11.43
  Top 2.54: 41.61,68.35 41.61,74.45 41.61,74.89 J6.P$1 41.64,68.38 41.61,68.35 | 41.61,68.35 41.61,66.14 41.61,54.05 46.22,49.44 71.81,49.44
  VCC 0.152: v69.14,70.22 v69.14,69.58 v69.8,69.58 69.75,69.58 v69.17,69 | v69.14,70.22 v69.78,70.22 | v70.41,70.22 70.46,70.17 v70.46,69.53 | v69.14,70.22 69.14,69.1 68.5,68.45 | v79.78,70.61 80.62,70.61 80.67,70.56 v80.67,69.85 | v79.78,70.61 v79.78,69.09 79.86,69.09 | 79.86,69.09 v80.67,69.09 v80.67,69.85 | v79.78,70.61 v79.78,69.85 79.86,69.77 79.86,69.09 | 87.61,68.05 85.8,69.85 v80.67,69.85
  VCC 0.508: v125,7.8 125,7.11 124.39,6.5 v116.41,6.5 110.92,6.5 v108.74,8.69 108.72,8.69 97.72,19.68 90.45,19.68 | v66.17,63.89 66.07,63.99 | v72.65,99.12 v72.64,99.12 72.63,99.12 71.68,98.17 37.14,98.17 36.4,97.43 v35.56,97.43 | v60.56,68.62 61.3,69.37 65.95,69.37 | 65.95,69.37 66.07,69.37 | v36.33,96.67 v35.56,96.67 v35.56,97.43 | 35.66,97.48 35.72,97.43 v35.56,97.43 | v65.2,68.62 65.95,69.37 | 69.04,68.62 v66.7,68.62 | 65.94,67.84 65.94,64.12 v66.17,63.89 | 65.92,68.72 65.92,64.15 v66.17,63.89
  VCC 1.016: J6.P$1 J6.P$2 44.18,71.62 47.18,68.62 v60.56,68.62 60.65,68.72 65.92,68.72 | 69.04,68.62 v65.2,68.62 | v97.08,69.98 96.95,69.98 96.67,69.7 96.65,69.67 | v90.5,19.68 90.45,19.68 90.4,19.68 87.99,22.1
  VCC 2.54: J6.P$2 44.18,70.02 45.75,68.45 68.5,68.45 69.57,69.53 | 90.45,19.68 87.61,22.52 | v80.67,69.85 96.52,69.85 96.67,69.7 | 87.99,22.1 87.61,22.48 87.61,68.05 87.61,68.99
  GND 0.508: v69.17,69 70.07,69 70.74,69.67
  Bottom 0.152: v88.67,15.39 v88.68,15.39 88.68,12.9 TP30.TP | J6.@2 J6.P$2 44.1,74.91 J6.P$1 | v28.63,102.31 34.17,102.31 34.19,102.29
  Bottom 0.254: 35.84,102.29 35.97,102.16 35.97,101.96
  Bottom 0.305: v70.1,110.41 69.67,110.41 67.97,108.71 v64.05,108.71 64.02,108.74 47.73,108.74 46.61,109.86 42.7,109.86 39.98,107.14 39.96,107.14 36.02,103.2 36.02,102.41 35.97,102.36 | 35.97,102.29 35.84,102.29 34.19,102.29 | v11.99,82.8 10.85,82.8 6.25,87.4 v6.25,95.2
  Bottom 0.508: J6.@2 44.1,76.94 44.1,74.91 | J6.P$1 J6.@1 | J6.@1 41.64,72.22 41.56,72.14 41.56,72.8 J6.@1 | 35.97,102.36 35.97,102.29 35.97,101.96 35.78,102.15 | 35.61,102.31 35.78,102.15 | v35.56,97.43 35.56,101.93 35.78,102.15 | v36.33,97.43 v36.33,96.67 | 35.08,101.6 34.37,102.31 v28.63,102.31 21.52,95.2 v6.25,95.2
  Bottom 4.064: J6.P$1 35.08,81.47 35.08,101.6
  other vias: 89.74,19.68 89.74,19.05 90.5,19.05 91.26,19.68 91.26,19.05 80.67,70.61 96.37,69.37 97.08,69.37 97.06,68.78 96.4,68.78
  pour Top: 36.58,97.76 arc-90 36.71,97.64 36.71,96.57 arc-90 36.43,96.29 35.36,96.29 arc-90 35.21,96.44 35.21,97.59 arc-90
  pour VCC: 35.38,97.76 36.55,97.76 arc-90 36.73,97.59 36.73,96.44 arc-90 36.6,96.32 35.28,96.32 arc-90 35.21,96.39 35.21,97.59 arc-90
  pour GND: 68.94,71.04 70.18,71.04 arc-90 70.92,70.31 70.92,69.55 arc-90 70.06,68.68 68.86,68.68 arc-90 68.63,68.91 68.63,70.74 arc-90
  pour Bottom (no thermals): 40.8,77.98 44.48,77.98 44.61,77.98 arc-90 45.11,77.47 45.11,72.52 arc-90 44.22,71.63 40.92,71.63 arc-90 40.29,72.26 40.29,77.47 arc-90
  pour Bottom: 33.94,103.63 36.48,103.63 arc-90 37.11,103 37.11,102.23 37.11,100.97 arc90 36.98,101.09 33.17,101.09 33.17,102.87 arc-90
  pour Top: 89.44,20.57 91.34,20.57 arc-90 91.72,20.19 91.72,19.18 arc-90 90.96,18.41 90.07,18.41 arc-90 89.31,19.18 89.31,20.45 arc-90
  pour VCC: 89.44,20.57 91.47,20.57 arc-90 92,20.04 92,19 arc-90 91.42,18.41 90.33,18.41 arc-90 89.31,19.43 89.31,20.45 arc-90
  pour Top: 68.86,70.99 70.77,70.99 arc90 71.78,72.01 71.78,72.14 arc-90 72.42,72.77 80.04,72.77 arc-90 81.18,71.63 81.18,68.83 arc-90 80.04,67.69 73.94,67.69 arc-90 73.05,68.58 73.05,68.83 arc90 72.55,69.34 71.02,69.34 arc90 70.89,69.22 70.89,69.16 arc-90 70.11,68.38 69.07,68.38 arc-90 68.61,68.83 68.61,70.74 arc-90
  pour Top (no thermals): 96.52,72.9 97.94,72.9 arc-90 98.17,72.67 98.17,72.59 98.17,69.27 98.17,68.78 arc-90 97.82,68.43 96.6,68.43 96.14,68.43 arc-90 96.04,68.53 96.04,70.13 arc-90 96.19,70.28 arc90 96.45,70.54 96.45,71.09 96.45,72.75 96.45,72.82 arc-90
  pour VCC: 79.43,71.12 81.26,71.12 arc-90 81.49,70.89 81.49,68.66 arc-90 81.41,68.58 79.43,68.58 arc-90 79.15,68.86 79.15,70.84 arc-90
  pour VCC: 95.79,71.07 97.92,71.07 arc-90 98.4,70.59 98.4,68.61 arc-90 98.28,68.48 95.76,68.48 arc-90 95.66,68.58 95.66,70.94 arc-90
  pour Top (no thermals): 41.25,77.95 44.48,77.95 44.88,77.95 arc-90 45.27,77.57 45.27,72.54 arc-90 44.48,71.75 40.72,71.75 arc-90 40.31,72.16 40.31,77.42 arc-90 40.85,77.95
  pour VCC (no thermals): 41.33,76.23 44.73,76.23 44.91,76.23 arc-90 45.34,75.79 45.34,73.86 arc-90 44.86,73.38 41.18,73.38 arc-90 40.62,73.94 40.62,75.54 arc-90 41.3,76.23
  pour VCC: 68.61,70.99 70.26,70.99 arc-90 70.89,70.36 70.89,69.22 arc-90 70.13,68.45 68.73,68.45 arc-90 68.35,68.83 68.35,70.74 arc-90
ADC0  (via drill 0.3 pad 0.5)
  Top 0.152: U$4.23 81.46,46.43 80.93,45.9 v79.88,45.9 | J15.4 102.71,56.4 102.35,56.03 v101.73,56.03 | J3.15 78.4,6.41 v78.4,8.6 79.7,9.9 79.7,14.71 77.71,16.7 v76.98,16.7 v76.97,16.69
  VCC 0.152: v76.97,16.69 76.99,16.71 76.99,26.97 80.17,30.15 80.17,45.62 v79.88,45.9
  Bottom 0.152: v101.73,56.03 101.71,56.01 89.43,56.01 86.05,52.63 86.05,48.28 83.63,45.87 79.91,45.87 v79.88,45.9 | v78.4,8.6 78.42,8.58 78.42,6.94 TP6.TP
ADC1  (via drill 0.3 pad 0.5)
  Top 0.152: U$4.33 v78.14,43.93 v78.13,43.92 | J15.6 105.25,56.35 104.94,56.03 v104.17,56.03 | v75.91,8.59 v75.9,8.6 | v75.9,8.6 75.13,9.37 72.8,9.37 v72.73,9.29 | J11.4 13.04,78.74 15.44,76.34 32.14,76.34 38.17,70.32 38.17,52.11 46.29,43.99 54.16,43.99 55.6,45.43 62.9,45.43 63.6,44.74 75.96,44.74 v76.05,44.83 | v75.9,8.6 76.01,8.49 J3.17
  VCC 0.152: v78.13,43.92 78.13,44.35 77.65,44.83 v76.05,44.83
  Bottom 0.152: v104.17,56.03 103.64,55.5 89.59,55.5 86.48,52.4 86.48,48.09 82.31,43.92 v78.13,43.92 68.05,43.92 58.82,34.69 58.82,18.04 60.43,16.43 70.05,16.43 71.84,14.64 71.84,10.99 72.73,10.1 v72.73,9.29 | v75.9,8.6 75.98,8.52 75.98,6.83 TP7.TP
ADC2  (via drill 0.3 pad 0.5)
  Top 0.152: U$4.35 82.28,43.41 v79.26,43.41 | J15.8 107.79,56.3 107.4,55.91 v106.76,55.91 | v73.5,8.6 73.52,8.58 73.47,8.54 J3.19 | J11.3 11.91,80.74 15.78,76.86 32.41,76.86 38.63,70.65 38.63,52.21 46.41,44.42 53.93,44.42 55.38,45.87 63.09,45.87 63.82,45.13 75.22,45.13 75.74,45.65 v76.88,45.65
  VCC 0.152: v76.88,45.65 78.3,45.65 79.26,44.7 v79.26,43.41
  Bottom 0.152: v106.76,55.91 105.85,54.99 89.74,54.99 86.91,52.17 86.91,47.73 82.6,43.41 v79.26,43.41 68.22,43.41 59.18,34.38 59.18,18.44 60.75,16.88 70.33,16.88 72.15,15.06 72.15,11.64 73.5,10.3 v73.5,8.6 TP9.TP 73.5,7.61
ADC3  (via drill 0.3 pad 0.5)
  Top 0.152: U$4.37 78.2,42.93 v78.13,42.86 | J15.10 110.33,56.27 109.97,55.91 v109.35,55.91 | J3.21 70.91,6.28 v70.91,8.49 v70.9,8.5 70.98,8.5 72.55,10.07 v72.55,15.59
  Bottom 0.152: v109.35,55.91 107.93,54.49 89.81,54.49 87.47,52.14 87.47,47.69 82.71,42.93 78.2,42.93 v78.13,42.86 76.66,42.86 76.57,42.95 68.29,42.95 59.56,34.22 59.56,18.95 61.13,17.39 70.65,17.39 72.44,15.59 v72.55,15.59 | v70.9,8.5 70.87,8.47 TP10.TP
ADC4  (via drill 0.3 pad 0.5)
  Top 0.152: U$4.41 v78.14,41.93 v78.13,41.94 | J15.12 112.87,56.07 112.58,55.78 v111.94,55.78 | J3.25 65.85,8.55 v65.8,8.6 68.01,8.6 69.87,10.46 69.87,18 v69.84,18.03
  Bottom 0.152: v78.13,41.94 78.14,41.96 | v111.94,55.78 110.11,53.95 89.98,53.95 87.95,51.92 87.95,47.49 82.42,41.96 78.14,41.96 | v65.8,8.6 65.8,6.88 TP12.TP | 78.14,41.96 76.86,41.96 76.22,42.6 68.53,42.6 60.05,34.12 60.05,19.1 61.15,18 69.8,18 v69.84,18.03
ADC5  (via drill 0.3 pad 0.5)
  Top 0.152: U$4.43 82.29,41.44 v79.26,41.44 | J15.14 115.41,55.99 115.07,55.65 v114.38,55.65 | J3.27 63.31,8.96 v63.4,9.05 63.55,9.2 67.97,9.2 69.47,10.7 69.47,17.35 68.24,18.58 v68.21,18.58
  Bottom 0.152: v114.38,55.65 112.15,53.42 90.14,53.42 88.36,51.64 88.36,47.19 82.62,41.44 v79.26,41.44 76.81,41.44 76.02,42.24 68.84,42.24 60.6,34.01 60.6,19.31 61.37,18.54 68.17,18.54 v68.21,18.58 | TP13.TP 63.27,6.79 63.27,8.92 v63.4,9.05
ADC6  (via drill 0.3 pad 0.5)
  Top 0.152: v78.13,40.93 U$4.45 | J3.29 60.77,8.62 v61.05,8.9 61.87,9.71 61.87,18.85 61.33,19.39 v61.33,19.42 | J6.@16 J6.P$16
  VCC 0.152: J6.P$16 61.96,93.53 63.72,91.77 70.94,91.77 73.77,88.95 73.77,65.34 62.68,54.26 62.68,35.17 v62.35,34.84
  Bottom 0.152: TP14.TP 60.67,6.77 60.67,8.52 v61.05,8.9 | v61.33,19.42 61.35,19.44 61.35,33.84 v62.35,34.84 68.44,40.93 v78.13,40.93 | J6.@16 J6.P$16
ADC7  (via drill 0.3 pad 0.5)
  Top 0.152: v79.26,40.44 v79.27,40.43 U$4.47 86.63,40.43 91.13,44.94 91.13,101.45 89.43,103.15 TP1.1 | J3.31 v58.23,9.02 58.23,9.03 59.46,10.26 59.46,19.32 60.25,20.11 v62.04,20.11
  Bottom 0.152: TP15.TP 58.24,6.81 58.24,9.01 v58.23,9.02 | v79.26,40.44 79.22,40.44 78.55,39.77 68.1,39.77 62.05,33.72 62.05,20.12 v62.04,20.11
CHG
  Top 0.152: J6.@13 69.58,98.69 68.97,99.3 R13.2
  Bottom 0.152: J6.@13 J6.P$13
CS  (via drill 0.3 pad 0.5, 0.35)
  Top 0.152: v58.05,41.55 58.71,41.55 60.5,39.75 72.69,39.75 73.12,40.18 U$4.48 75.81,40.18 76.4,40.77 76.4,42.99 77.96,44.55 88.71,44.55 90.82,46.66 90.82,98.27 90.65,98.45 v90.62,98.45 | J10.11 112.64,113.59 v111.91,113.59 | J3.34 55.69,14.81 v55.74,14.85
  VCC 0.152: v111.91,113.59 108.33,113.59 93.19,98.45 v90.62,98.45 | v49.81,19.03 51.61,19.03 55.74,14.9 v55.74,14.85
  Bottom 0.152: TP41.TP 55.74,12.79 v55.74,14.85 | v49.81,19.03 49.8,19.03 49.8,39.18 52.33,41.71 57.89,41.71 v58.05,41.55
CTS  (via drill 0.3 pad 0.5)
  Top 0.152: U$4.40 72.62,42.18 72.27,42.54 63.78,42.54 62.09,44.23 58.42,44.23 56.95,42.76 51.61,42.76 v51.57,42.72 | J3.26 65.85,10.1 v65.81,10.05
  Bottom 0.152: TP39.TP 65.81,12.65 v65.81,10.05 65.77,10.09 55.62,10.09 54.61,11.1 54.61,15 53.83,15.79 50.31,15.79 48.64,17.45 48.64,39.8 v51.57,42.72
GND  (via drill 0.3 pad 0.5, 0.35)
  Top 0.152: 77.74,107.68 D23.2 | 80.22,107.68 R3.2 | C2.2 81.09,107.63 R3.2 | U2.4 60.89,60.11 60.5,60.51 v60.45,60.51 | v65.66,62.65 | LED2.2 101.33,4.88 v100.59,4.88 | J3.1 97.42,6.26 v97.44,6.27 | 83.57,39.93 v83.61,39.89 | JTAG.9 v68.11,111.75 v68.1,111.74 | JTAG.5 v65.57,111.67 v65.56,111.66 | JTAG.3 v64.3,111.68 | LED1.2 28.67,109.39 v28.7,109.42 | D4.A 43.21,108.23 v43.26,108.18 | 57.25,110.82 v57.25,110.67 | 56.24,107.86 R9.2 R10.2 | 57.29,107.86 56.81,107.86 | R28.2 67.68,70.52 v67.66,70.52 | C1.2 107.36,8.42 v107.29,8.48 | RESET.2 106,4.47 v106,3.73 | RESET.1 109.73,3.78 v109.76,3.76 | MODE.2 v121.6,4.49 v121.59,4.5 | MODE.1 v127.58,4.49 v127.59,4.5 | MS1.4 MS1.4' 102.31,71.88 102.31,69.88 v102.34,69.85 | R10.2 58.51,107.77 58.51,107.57 | v55.55,8.74 55.55,6.96 55.69,6.82 J3.33 | R27.2 63.92,70.56 v63.93,70.57 | R29.2 71.46,68.6 71.19,68.32 v71.15,68.36 | v68.85,107.26 68.87,107.26 U1.2 | v83.35,31.68 82.99,31.68 82.33,32.33 U$4.76 83.16,32.33 v83.35,32.52 | v82.74,54.23 82.74,53.36 82.42,53.03 U$4.77 80.63,53.03 | v81.2,54.28 v81.2,54.27 81.2,52.99 | J3.9 86.17,3.9 v86.13,3.86 | J3.7 88.71,6.2 | 88.71,6.2 88.71,3.93 v88.67,3.89 | J3.5 v91.25,4 v91.27,3.99 | J3.3 93.79,3.95 v93.75,3.91 | U$4.49 82.29,39.95 77.7,39.95 75.95,38.19 | R74.1 64.33,107.37 v64.26,107.44 | v33.59,111.84 v33.58,111.84 | v5.11,97.41 5.09,97.39 5.09,97.31 | v83.58,46.83 83.48,46.93 U$4.21 | U$4.15 81.51,48.43 81.28,48.21 80.27,48.21 v79.97,48.5 | 88.66,6.26 88.71,6.2 | J6.P$9 62,74.91 | 62,74.91 J6.P$10 | J6.@9 61.96,73.15 61.96,74.86 62,74.91 | U$4.1 82.3,52.73 81.87,53.16 80.9,53.16 80.5,53.56 v80.5,54.31 | U$4.39 79.27,42.43 v79.26,42.45 | 56.92,60.69 v56.95,60.72
  Top 0.152: 49.26,95.33 49.26,95.25 J6.P$21 | U$4.9 81.36,49.93 80.88,50.42 v80.22,50.42 | R1.2 79.27,107.63 80.19,107.63 R3.2 | R22.1 43.46,106.27 v43.56,106.38
  Top 0.305: C8.2 56.67,63.18 v56.95,63.18 | C10.2 56.88,61.82 v56.95,61.76 | C9.2 56.92,60.69 | U2.7 v65.66,62.65 | 81.37,107.56 R5.2 81.37,108.61 81.83,109.07 81.83,110.76 80.6,111.99 USB2.GND | 81.37,107.56 C2.2 | USB2.GND2 74.15,111.74 73.66,111.25 v72.75,111.25 | USB1.GND2 49.76,111.9 49.44,111.58 v47.68,111.58 | USB1.GND 57.25,111.14 57.25,110.82 | U$4.56 74.75,38.19 75.95,38.19 | U$4.49 83.57,39.93 | S1.2 19.67,115.39 19.64,115.42 21.58,115.42 S1.2 | D1.2 54.81,107.86 56.24,107.86 | R6.2 56.81,107.86 | 56.81,107.86 R9.2 | R9.2 58.43,107.86 58.51,107.77 | R10.2 | R10.2 C3.2 59.61,107.52 v59.92,107.2 | v56.75,107.2 56.75,107.79 56.81,107.86 | v57.77,107.2 57.4,107.56 R9.2 | v58.88,107.2 58.51,107.57 R10.2 | v76.87,107.65 77.66,107.65 D23.2 79.07,107.7 R1.2 | 79.26,107.64 79.27,107.63 | R1.2 80.19,107.63 | R3.2 81.3,107.63 81.37,107.56 | J1.2 v33.59,111.84 | S1.5 S1.2 | v20.45,103.63 v20.46,103.63 D17.A
  Top 0.508: v102.24,78.69 102.24,76.34 MS1.4 102.31,71.88 | MS1.4' 102.34,71.92 v102.34,69.85 | J6.P$22 46.73,95.25 49.26,95.25 | J6.P$21 49.26,95.33 | C20.2 58.3,65.42 v58.35,65.37 | v44.99,61.86 45.97,61.86 D16.A 46.01,65.06 C61.2 46.33,65.42 45.7,66.05 v44.94,66.05 | J4.1 5.09,97.31 | J4.1 v6.66,96.28 6.69,96.24 | J4.1 3.2,96.28 3.2,96.27 | J11.1 12.04,84.74 v12.07,84.71 | J11.1 9.72,86.24 9.71,86.26 | J11.1 6.62,84.74 6.59,84.71
  Top 1.016: J2.3 13.7,112.54 16.52,112.54 | J2.3 10.21,112.46 10.18,112.44 | J2.3 13.62,114.96 | J2.3 13.62,110.97 13.43,110.78 11.57,110.78 | J2.2 8.82,112.63 9.06,112.86 | J2.2 5.72,109.46 5.21,109.97 | J2.2 8.82,106.1 7.79,105.07 | J2.2 10.23,109.46 11.5,110.74 | J6.@21 49.26,95.33 | 49.11,93.38 49.26,93.52 J6.P$21 J6.P$22 | J6.P$22 46.72,96.94 46.79,97.01 | J6.P$22 J6.@22 | J6.@22 48.46,93.19 48.52,93.25 | J6.@22 45.57,93.19 v45.55,93.22 | J6.@22 46.72,91.23 46.69,91.2 | J6.@21 49.2,97.21 48.06,97.21 | J6.@21 49.31,97.31 50.01,97.31 | J6.@21 49.26,98.26 49.25,98.27 | J6.P$10 J6.P$9 | J6.P$9 61.96,76.96 | 61.96,76.96 61.96,77.28 62.01,77.33 | J6.@10 61.98,76.94 61.96,76.96 | J6.@10 64.5,78.67 64.56,78.73 | J6.@10 J6.P$10 | J6.P$10 64.5,73.18 64.38,73.06 | J6.P$9 61.96,73.15 | 63.94,72.95 62.03,72.95 J6.@9 | J6.@9 61.91,72.92 60.11,72.92 | J6.P$9 61.04,74.91 61.02,74.89 | J6.@9 61.96,71.15 61.88,71.07
  Bottom 0.152: X3.5 X3.4 | D12.1 15.03,25.57 v15.01,25.58 | U7.1 v13.47,24.38 v13.46,24.38 | v13.9,16.84 13.9,16.17 C7.2 13.9,16.14 D7.1 13.9,14.43 J13.C5 v12.38,11.84 v12.37,11.84 | v18.55,16.13 17.95,16.13 C6.2 17.93,15.17 D11.1 v18.54,15.16 v18.55,15.16 | v15.9,16.89 v15.91,16.88 C4.2 15.89,16.13 D13.1 v15.89,14.44 v15.88,14.43 | v17.83,25.6 C5.2 | v45.52,14.84 TP29.TP | TP16.TP 22.64,8.14 v22.02,8.76 | J6.P$21 46.89,95.23 | 46.89,95.23 J6.P$22 | J6.@22 46.72,93.22 46.72,95.06 46.89,95.23
  Bottom 0.305: v44.81,111.07 44.76,111.12 S4.3 S4.6 41.56,111.15 v41.61,111.1
  Bottom 0.508: J6.P$22 46.72,93.22 | J6.P$21 J6.@21 | J6.P$9 J6.@9 | J6.P$10 J6.@10
  other vias: 65.58,110.79 71.54,41.65 71.52,40.3 58.75,42.86 61.24,42.89 10.29,117.6 12.83,117.6 15.37,117.6 17.91,117.6 10.29,115.06 13.54,115.04 15.37,115.06 2.57,99.95 2.57,102.49 2.57,105.03 2.57,107.57 2.57,110.11 5.11,110.11 5.11,107.57 5.11,105.03 5.11,102.49 5.11,99.95 7.65,99.95 7.65,102.49 7.65,105.03 3.23,96.29 2.57,89.79 2.57,84.71 2.57,82.17 2.57,79.63 2.57,74.55 2.57,72.01 7.65,74.55 12.73,74.55 17.81,74.55 22.89,74.55 27.97,74.55 27.97,66.93 22.89,66.93 17.81,66.93 12.73,66.93 27.97,61.85 27.97,56.77 27.97,51.69 27.97,46.61 27.97,41.53 27.97,36.45 22.89,61.85 17.81,61.85 12.73,61.85 12.73,56.77 12.73,51.69 17.81,51.69 22.89,51.69 22.89,46.61 17.81,46.61 12.73,46.61 12.73,41.53 17.81,41.53 22.89,41.53 22.89,36.45 17.81,36.45 12.73,36.45 12.73,31.37 12.73,26.29 17.81,31.37 22.89,31.37 2.57,11.05 7.65,11.05 20.45,108.71 20.45,106.17 25.53,108.71 22.99,108.71 22.99,106.17 25.53,106.17 22.99,103.63 25.53,103.63 33.05,66.93 33.05,61.85 33.05,56.77 33.05,51.69 33.05,46.61 33.05,36.45 38.13,36.45 43.21,36.45 28.7,111.96 28.7,114.5 64.31,110.79 64.3,115.49 65.57,115.49 66.84,115.49 68.11,115.49 69.38,115.49 69.38,114.22 69.38,112.95 69.38,111.68 17.81,79.63 17.81,82.17 17.81,84.71 17.81,87.25 15.27,87.25 15.27,84.71 15.27,82.17 15.27,79.63 27.97,31.37 33.05,32.64 38.13,32.64 43.21,32.64 95.32,89.92 99.13,89.92 102.94,89.92 106.75,89.92 110.56,89.92 114.37,89.92 118.18,89.92 121.99,89.92 125.8,89.92 129.61,89.92 133.42,89.92 95.32,87.38 99.13,87.38 102.94,87.38 106.75,87.38 110.56,87.38 114.37,87.38 118.18,87.38 121.99,87.38 125.8,87.38 129.61,87.38 133.42,87.38 95.32,84.84 95.32,82.3 99.13,84.84 102.94,84.84 106.75,84.84 110.56,84.84 114.37,84.84 118.18,84.84 121.99,84.84 125.8,84.84 129.61,84.84 133.42,84.84 99.13,82.3 102.94,82.3 106.75,82.3 110.56,82.3 114.37,82.3 118.18,82.3 121.99,82.3 125.8,82.3 129.61,82.3 133.42,82.3 95.32,79.76 99.13,79.76 102.94,79.76 106.75,79.76 110.56,79.76 114.37,79.76 118.18,79.76 121.99,79.76 125.8,79.76 129.61,79.76 99.13,93.73 99.13,97.54 137.23,89.92 137.23,93.73 137.23,97.54 137.23,101.35 137.23,105.16 137.23,108.97 133.42,108.97 133.42,105.16 129.61,105.16 129.61,108.97 108.02,117.86 110.56,117.86 113.1,117.86 115.64,117.86 118.18,117.86 120.72,117.86 123.26,117.86 125.8,117.86 129.61,117.86 129.61,115.32 129.61,112.78 137.23,87.38 137.23,84.84 137.23,82.3 133.42,79.76 137.23,79.76 137.23,77.22 137.23,74.68 137.23,72.14 137.23,69.6 137.23,67.06 137.23,64.52 137.23,61.98 137.23,59.44 137.23,56.9 137.23,54.36 137.23,51.82 134.69,69.6 134.69,67.06 134.69,64.52 134.69,61.98 134.69,59.44 134.69,56.9 134.69,54.36 134.69,51.82 132.15,51.82 129.61,51.82 127.07,51.82 132.15,54.36 132.15,56.9 132.15,59.44 132.15,61.98 132.15,64.52 132.15,67.06 95.32,110.24 97.86,110.24 97.86,108.97 95.32,108.97 95.32,106.43 97.86,106.43 95.32,103.89 101.67,97.54 101.67,93.73 88.97,89.92 88.97,87.38 88.97,84.84 88.97,82.3 88.97,79.76 86.43,89.92 86.43,87.38 86.43,84.84 86.43,82.3 86.43,79.76 88.97,77.22 86.43,77.22 86.43,74.68 88.97,74.68 86.43,72.14 88.97,72.14 92.78,59.44 92.78,61.98 92.78,64.52 92.78,67.06 90.24,67.06 90.24,64.52 90.24,61.98 90.24,59.44 95.32,59.44 97.86,59.44 95.32,61.98 97.86,61.98 95.32,64.52 85.16,61.98 85.16,59.44 76.27,59.44 78.81,61.98 78.81,64.52 78.81,67.06 44.94,63.97 44.94,62.8 44.94,60.9 46.21,60.9 46.21,62.8 46.04,63.96 46.85,63.96 44.94,65.34 44.94,64.63 58.35,66.18 58.35,64.66 59.16,66.18 59.16,65.37 59.16,64.66 58.22,63.18 59.49,63.18 58.22,61.76 59.49,61.76 58.22,60.72 59.49,60.72 58.22,59.45 59.49,59.45 56.95,59.45 79.06,95.63 80.46,95.63 81.22,95.63 82.74,95.63 79.06,94.87 80.46,94.87 79.06,94.11 80.46,94.11 81.22,94.87 82.74,94.87 81.22,94.11 82.74,94.11 78.6,100.36 80.61,100.41 78.63,99.06 80.56,98.53 82.87,100.24 82.87,98.97 56.75,105.68 57.76,105.68 58.88,105.68 79.06,90.93 79.06,89.03 79.06,87.12 79.06,84.58 79.06,82.04 79.06,79.5 79.06,76.96 79.06,74.42 80.46,90.93 81.22,90.93 82.74,90.93 80.46,89.03 80.46,87.12 80.46,84.58 80.46,82.04 80.46,79.5 80.46,76.96 80.46,74.42 81.22,89.03 82.74,89.03 81.22,87.12 82.74,87.12 81.22,84.58 82.74,84.58 81.22,82.04 82.74,82.04 81.22,79.5 82.74,79.5 81.22,76.96 82.74,76.96 81.22,74.42 82.74,74.42 81.22,66.8 82.74,66.8 81.14,58.12 82.74,58.04 88.04,118.02 84.86,118.02 76.61,118.02 74.7,118.02 74.7,115.48 76.61,115.48 78.51,118.02 78.51,115.48 84.86,115.48 112.02,15.04 114.56,15.04 117.1,15.04 119.64,15.04 122.18,15.04 124.72,15.04 127.26,15.04 129.8,15.04 132.34,15.04 134.88,15.04 137.42,15.04 112.02,12.5 114.56,12.5 117.1,12.5 119.64,12.5 122.18,12.5 124.72,12.5 127.26,12.5 129.8,12.5 132.34,12.5 134.88,12.5 137.42,12.5 119.64,9.96 122.18,9.96 124.72,9.96 127.26,9.96 129.8,9.96 132.34,9.96 134.88,9.96 137.42,9.96 21.85,2.34 25.66,2.34 28.2,2.34 30.74,2.34 33.28,2.34 35.82,2.34 38.36,2.34 40.9,2.34 43.44,2.34 45.98,2.34 48.52,2.34 51.06,2.34 53.6,2.34 56.14,2.34 58.68,2.34 61.22,2.34 63.76,2.34 66.3,2.34 68.84,2.34 71.38,2.34 73.92,2.34 76.46,2.34 79,2.34 81.54,2.34 84.08,2.34 86.62,2.34 88.67,1.35 91.21,1.35 93.75,1.35 96.29,1.35 98.83,1.35 101.37,1.35 103.91,1.35 106.45,1.35 108.99,1.35 111.53,1.35 114.07,1.35 116.61,1.35 119.15,1.35 121.69,1.35 124.23,1.35 126.77,1.35 129.31,1.35 131.85,1.35 112.8,2.62 115.34,2.62 117.88,2.62 120.42,2.62 122.96,2.62 125.5,2.62 128.04,2.62 130.58,2.62 22.99,99.82 22.99,101.09 22.99,102.36 25.53,102.36 25.53,101.09 30.61,99.82 28.07,99.82 40.29,103.86 41.56,103.86 42.83,103.86 39.02,103.86 44.1,103.86 66.97,110.41 68.12,110.79 66.07,21.21 68.61,21.21 71.15,21.21 74.96,21.21 66.07,22.48 68.61,22.48 71.15,22.48 74.96,22.48 74.96,19.94 74.96,18.67 74.96,17.4 74.96,16.13 72.42,21.21 72.42,22.48 72.42,19.94 72.42,18.67 80.04,18.67 80.04,17.4 17.81,78.36 20.35,78.36 22.89,78.36 25.43,78.36 27.97,78.36 30.51,78.36 33.05,78.36 34.32,77.09 35.59,75.82 36.86,74.55 38.13,73.28 39.4,72.01 39.4,69.47 39.4,66.93 39.4,64.39 39.4,61.85 39.4,59.31 39.4,56.77 39.4,54.23 40.67,51.69 41.94,50.42 43.67,65.34 43.67,62.8 43.67,60.26 43.67,57.72 43.67,55.18 46.21,57.72 46.21,55.18 46.21,52.64 47.96,93.95 47.96,93.14 47.96,92.38 45.54,93.9 45.54,92.43 46.41,91.74 47.09,91.72 57.33,111.43 12.02,7.62 11.99,5.94 11.64,2.77 12.37,10.57 12.37,9.3 14.91,9.3 14.91,10.57 14.91,11.84 17.45,9.3 17.45,10.57 19.99,9.3 19.99,10.57 17.45,8.03 109.48,15.04 106.94,15.04 109.48,12.5 106.94,12.5 55.41,115.49 54.14,115.49 52.87,115.49 51.6,115.49 50.33,115.49 68.83,108.18 68.01,107.29 68.61,24.38 71.15,24.38 72.42,24.38 74.96,24.38 79.4,24.38 80.67,23.11 81.94,20.57 83.21,19.3 84.48,18.03 85.75,16.76 81.31,28.19 81.31,26.92 83.21,28.19 83.21,26.92 83.21,25.65 83.21,24.38 48.87,45.28 50.65,47.31 52.17,47.31 53.44,47.31 47.09,47.56 45.19,47.56 43.08,49.28 44.1,48.39 39.14,50.04 40.29,48.9 41.43,47.75 42.45,46.74 43.59,45.59 47.09,43.12 43.59,43.94 43.59,42.55 43.59,41.15 43.59,39.62 43.59,38.1 20.35,87.25 20.35,84.71 20.35,82.17 20.35,79.63 59.9,105.63 19.6,115.4 79.14,107.01 80.44,107 58.58,115.49 58.58,118.03 20.68,97.13 20.68,96.34 20.68,98.17 36.15,105.87 37.04,105.87 13.49,110.72 16.51,112.57 10.32,112.52 8.84,112.83 3.99,97.38 6.23,97.41 9.71,86.28 6.58,84.71 31.8,106.98 30.33,107.09 33.56,111.05 34.34,111.84 34.32,111.05 34.29,110.26 35.03,111.05 35.03,110.26 79.78,107
  pour Top (isolate 0.279, rank 3): 0.03,119.95 0.03,0 139.93,0 139.93,119.95
  pour Bottom (isolate 0.279, rank 3): 0.03,122.05 0.03,0 139.91,0 139.91,122.05
  cutout Bottom: 13.31,6.38 13.31,3.07 15.34,3.07 15.34,6.38
  cutout VCC: 13.31,6.38 13.31,3.07 15.34,3.07 15.34,6.38
  cutout Top: 13.31,6.38 13.31,3.07 15.34,3.07 15.34,6.38
  pour GND (rank 3, no thermals): -5.18,127 147.35,127 147.35,-3.43 -5.31,-3.43 -5.81,-3.94 -5.81,127
  cutout VCC (no thermals): 12.55,107.34 14.63,107.34 arc-90 15.57,106.4 15.57,106.17 arc-90 14.81,105.41 12.5,105.41 arc-90 11.61,106.3 11.61,106.4 arc-90
  cutout GND (no thermals): 12.6,107.34 14.63,107.34 arc-90 15.57,106.4 15.57,106.12 arc-90 14.86,105.41 12.52,105.41 arc-90 11.59,106.35 arc-90 12.58,107.34
GND1  (via drill 3 pad 6)
  other vias: 136,115.6
GND2  (via drill 3 pad 6)
  other vias: 4.5,116.23
GND3  (via drill 3 pad 6)
  other vias: 4.5,4
GND4  (via drill 3 pad 6)
  other vias: 136,4
GPIO0  (via drill 0.3 pad 0.5)
  Top 0.152: U$4.62 72.03,36.68 71.67,37.04 57.76,37.04 56.66,38.14 v54.76,38.14 | J3.48 37.91,14.79 v37.77,14.94 37.53,15.17 37.53,19.85 42.66,24.98 v53.27,24.98 | v53.27,24.98 | J10.19 123.03,113.55 122.68,113.9 v122.09,113.9
  VCC 0.152: v122.09,113.9 119.91,113.9 118.97,112.95 108.39,112.95 93.36,97.92 78.34,97.92 v78.1,98.17 | v54.76,38.14 54.76,49.09 71.99,66.31 71.99,85.95 v68.33,89.61
  Bottom 0.152: v37.77,14.94 37.91,14.79 TP48.TP | v54.76,38.14 54.76,38.08 53.27,36.59 v53.27,24.98 | v78.1,98.17 74.44,98.17 68.33,92.05 v68.33,89.61
GPIO1  (via drill 0.3 pad 0.5)
  Top 0.152: U$4.64 71.78,36.18 71.32,36.64 57.34,36.64 56.54,37.44 v55.39,37.44 v55.39,37.43 | J3.50 35.33,12.52 v35.33,14.94 35.1,15.17 35.1,20.31 40.79,26 v53.77,26 | v119.55,112.58 120.49,112.58 J10.17 | J6.P$25 J6.@25
  VCC 0.152: v119.55,112.58 119.54,112.59 108.64,112.59 93.52,97.48 71.76,97.48 71.75,97.48 41.35,97.48 J6.P$25 39.1,92.46 41.4,90.16 68.72,90.16 72.32,86.56 72.32,66.15 55.4,49.23 55.4,37.45 v55.39,37.43
  Bottom 0.152: TP49.TP 35.38,14.88 v35.33,14.94 | v53.77,26 53.77,35.78 55.39,37.4 v55.39,37.43 | J6.P$25 J6.@25
LED_BLUE  (via drill 0.3 pad 0.5)
  Top 0.152: U$4.65 78.17,35.93 v78.15,35.95 | J3.49 v35.37,9.14 36.35,10.12 36.35,20.3 41.52,25.48 54.81,25.48 55.57,26.24 v68.07,26.24 79.94,26.24 87.66,18.52 87.66,3.71 88.44,2.92 110.57,2.92 111.36,3.71 111.36,7.9 113.06,9.6 116.86,9.6 117.26,9.19 R8.1
  Bottom 0.152: v78.15,35.95 72.87,35.95 68.03,31.11 68.03,26.28 v68.07,26.24 | TP24.TP 35.38,9.13 v35.37,9.14
LED_BLUE1
  Top 0.152: RGB.BLUE 115.46,4.77 R8.2
LED_GREEN  (via drill 0.3 pad 0.5)
  Top 0.152: U$4.63 79.27,36.43 v79.26,36.45 | J3.47 v37.91,9.04 39.11,10.23 39.11,20.3 43.29,24.48 54.53,24.48 55.68,25.63 v67.31,25.63 67.33,25.61 79.62,25.61 87.02,18.2 87.02,3.73 88.29,2.46 110.59,2.46 111.69,3.56 111.69,5.44 112.05,5.8 R19.1
  Bottom 0.152: v79.26,36.45 79.24,36.43 72.8,36.43 67.31,30.95 v67.31,25.64 v67.31,25.63 | TP23.TP v37.91,9.04
LED_GREEN1
  Top 0.152: RGB.GREEN 112.9,4.72 R19.2
LED_RED  (via drill 0.3 pad 0.5, 0.35)
  Top 0.152: v78.13,36.91 78.15,36.93 U$4.61 | J3.45 v40.45,9.12 40.45,9.23 41.58,10.36 41.58,20.21 44.76,23.38 54.31,23.38 56.08,25.15 v66.37,25.15 | R20.1 115.52,7.88
  Top 0.305: R20.1 115.52,8.69 v115.6,8.76
  Bottom 0.152: TP22.TP 40.49,9.08 v40.45,9.12 | v66.37,25.15 v66.36,25.15 66.36,30.64 72.64,36.92 78.12,36.92 v78.13,36.91 79.04,36.91 79.06,36.93 80.22,36.93 82.65,34.49 82.65,22.02 86.29,18.39 97.72,18.39 106.1,10.01 114.35,10.01 v115.6,8.76
LED_RED1
  Top 0.305: RGB.RED 114.4,7.62 R20.2
LI+
  Top 0.508: J10.2 100.17,104.36 104.85,99.69 MS1.28' 104.79,99.38 104.51,99.1 104.51,94.84 104.79,94.56 MS1.28
MISO  (via drill 0.3 pad 0.5)
  Top 0.152: J3.36 53.28,12.61 v53.28,14.85 53.28,14.95 | J15.20 123.03,56.02 122.67,55.65 v122,55.65 | U$4.50 73.17,39.68 72.87,39.38 60.03,39.38 58.72,40.69 v58.66,40.69
  VCC 0.152: v50.48,18.22 50.5,18.24 51.23,18.24 53.28,16.19 v53.28,14.85
  Bottom 0.152: TP42.TP 53.28,12.96 v53.28,14.85 | v50.48,18.22 50.48,39.15 52.47,41.14 57.36,41.14 57.82,40.69 v58.66,40.69 59.84,40.69 67.13,47.98 81.68,47.98 83.63,49.93 83.63,53.08 88.53,57.99 119.66,57.99 v122,55.65
MOSI  (via drill 0.3 pad 0.5)
  Top 0.152: U$4.52 73.3,39.18 73.15,39.03 59.63,39.03 58.76,39.9 v58,39.9 | J15.18 120.49,55.99 120.15,55.65 v119.56,55.65 | v51.17,17.07 51.01,17.07 50.5,16.56 v50.5,14.66 v50.49,14.65 50.49,12.61 J3.38
  Bottom 0.152: TP43.TP 50.49,12.87 v50.49,14.65 | v51.17,17.07 51.11,17.12 51.11,38.89 52.89,40.66 56.98,40.66 57.74,39.9 v58,39.9 59.61,39.9 67.33,47.62 81.93,47.62 84.05,49.74 84.05,52.87 88.84,57.66 117.55,57.66 v119.56,55.65
N$1
  Top 0.152: 79.15,108.71 R1.1 79.05,108.7 79.05,109.09 78.62,109.52 USB2.A5
N$2  (via drill 0.3 pad 0.5)
  Top 0.152: R3.1 80.27,109.21 v80.25,109.23 | v75.9,113.69 75.62,113.41 USB2.B5
  VCC 0.152: v75.9,113.69 76.03,113.82 78.26,113.82 78.79,113.28 78.79,109.8 79.4,109.19 80.25,109.19 v80.25,109.23
N$3
  Top 0.152: 82.34,108.58 R5.1
  Top 0.305: USB2.SHLD2 USB2.SHLD8 USB2.SHLD6 USB2.SHLD3 81.69,112.19 82.34,111.55 82.34,108.58 | R5.1 C2.1
N$4
  Top 0.152: USB1.A5 54.23,109.92 54.65,109.51 55.61,109.51 R6.1
N$5  (via drill 0.3 pad 0.5)
  Top 0.152: v51.23,113.79 USB1.B5 | v57.33,109.7 57.4,109.63 R9.1
  VCC 0.152: v51.23,113.79 51.59,114.15 53.6,114.15 54.23,113.51 54.23,109.86 54.64,109.45 57.08,109.45 v57.33,109.7
N$6
  Top 0.152: JTAG.1 63.03,111.02 62.28,110.28 D2.2
N$7
  Top 0.152: 38.98,108.18 D4.C
  Top 0.508: 39.03,109.57 38.98,109.53 R23.2
  Top 1: J1.1 35.59,113.01 39.03,109.57 D4.C
N$8
  Top 0.305: C3.1 59.59,108.84 59.57,108.82 R10.1
  Top 0.508: C3.1 59.69,108.9 59.69,110.08 57.3,112.47 USB1.SHLD3 USB1.SHLD6 USB1.SHLD8 USB1.SHLD2
N$9
  Top 0.152: U1.4 67.9,108.21 R7.1 67.91,109.59 R2.1
N$11
  Top 0.152: Q4.2 19.4,95.01 R14.2 17.95,94.8 F5.2
  pour Top (no thermals): 13.74,95.89 16.54,95.89 arc-90 16.92,95.5 arc90 17.17,95.25 18.7,95.25 arc90 18.95,95.5 18.95,95.89 arc-90 19.08,96.01 19.97,96.01 arc-90 20.35,95.63 20.35,92.25 arc-90 19.81,91.72 13.72,91.72 arc-90 13.49,91.95 13.49,95.63 arc-90
N$12
  Top 0.152: R13.1 LED3.2
N$13  (via drill 0.3 pad 0.5)
  Top 0.152: 65.78,104.9 R18.1 | 65.78,104.9 v65.79,104.88 | 65.78,104.9 R32.1 65.81,105.57 R18.1 | R18.1 R74.2
N$14
  Top 0.152: J8.2 64.77,105.47 R32.2
N$16
  Top 0.457: 115.01,100.31 MS1.24' MS1.24
  Top 0.508: 115.34,100.13 115.01,99.79 115.01,100.31 114.58,100.31 110.31,104.57 110.31,106.83 J10.10
N$17
  Top 0.152: 18.57,97.03 R15.2
  Top 0.305: R15.2 R14.1 | Q4.1 19.51,97.03 18.57,97.03
N$18  (via drill 0.3 pad 0.5)
  Top 0.305: R15.1 18.11,98.04 v18.11,98.75
  Bottom 0.152: S1.3 20.56,117.89
  Bottom 0.203: S1.3 21.74,117.89 S1.6
  Bottom 0.305: v18.11,98.75 18.11,115.44 20.56,117.89 21.74,117.89 | S1.3 S1.6
N$19
  Top 0.305: LED1.1 R16.1
N$20  (via drill 0.35)
  Top 0.305: R33.1 36.57,110.3 v36.6,110.34
  Bottom 0.305: v36.6,110.34 36.6,114.35 40.14,117.89 S4.4 S4.1
N$21
  Top 0.508: J15.3 102.71,67.23 104.83,69.34 104.83,71.93 MS1.5' MS1.5
N$23
  Top 0.508: J15.5 105.25,67.18 107.42,69.34 107.42,72.85 | 107.42,72.85 107.39,72.82 MS1.6' | MS1.6 107.42,76.24 107.42,72.85
N$24
  Top 0.508: MS1.7 MS1.7' 109.93,69.11 107.88,67.06 107.88,63.13 J15.7
N$25
  Top 0.508: J15.9 110.33,65.51 110.33,67.08 112.47,69.21 MS1.8' MS1.8
N$26
  Top 0.152: J15.11 112.91,63.02 112.91,62.64
  Top 0.508: MS1.9 MS1.9' 115.01,69.01 112.91,66.9 112.91,62.64 113.06,62.48
N$27
  Top 0.508: J15.13 115.41,66.82 117.55,68.96 MS1.10' MS1.10
N$28
  Top 0.508: MS1.11 MS1.11' 120.09,69.06 117.94,66.9 117.94,63.07 J15.15
N$29
  Top 0.508: J15.17 120.49,66.87 122.63,69.01 MS1.12' MS1.12
N$30
  Top 0.508: MS1.13 MS1.13' 125.17,68.96 123.03,66.82 J15.19
N$31
  Top 0.508: MS1.14 MS1.14' 127.71,68.75 125.57,66.62 J15.21
N$32
  Top 0.508: MS1.15 130.25,74.9 130.06,74.71 130.06,73.51 130.25,73.32 MS1.15' 130.25,68.53 128.11,66.39 J15.23
N$33
  Bottom 0.305: S1.1 S1.4
N$34
  Top 0.508: MS1.17 133.13,94.56 133.13,98.95 132.79,99.29 MS1.17' 132.79,100.25 128.11,104.93 J10.24
N$35